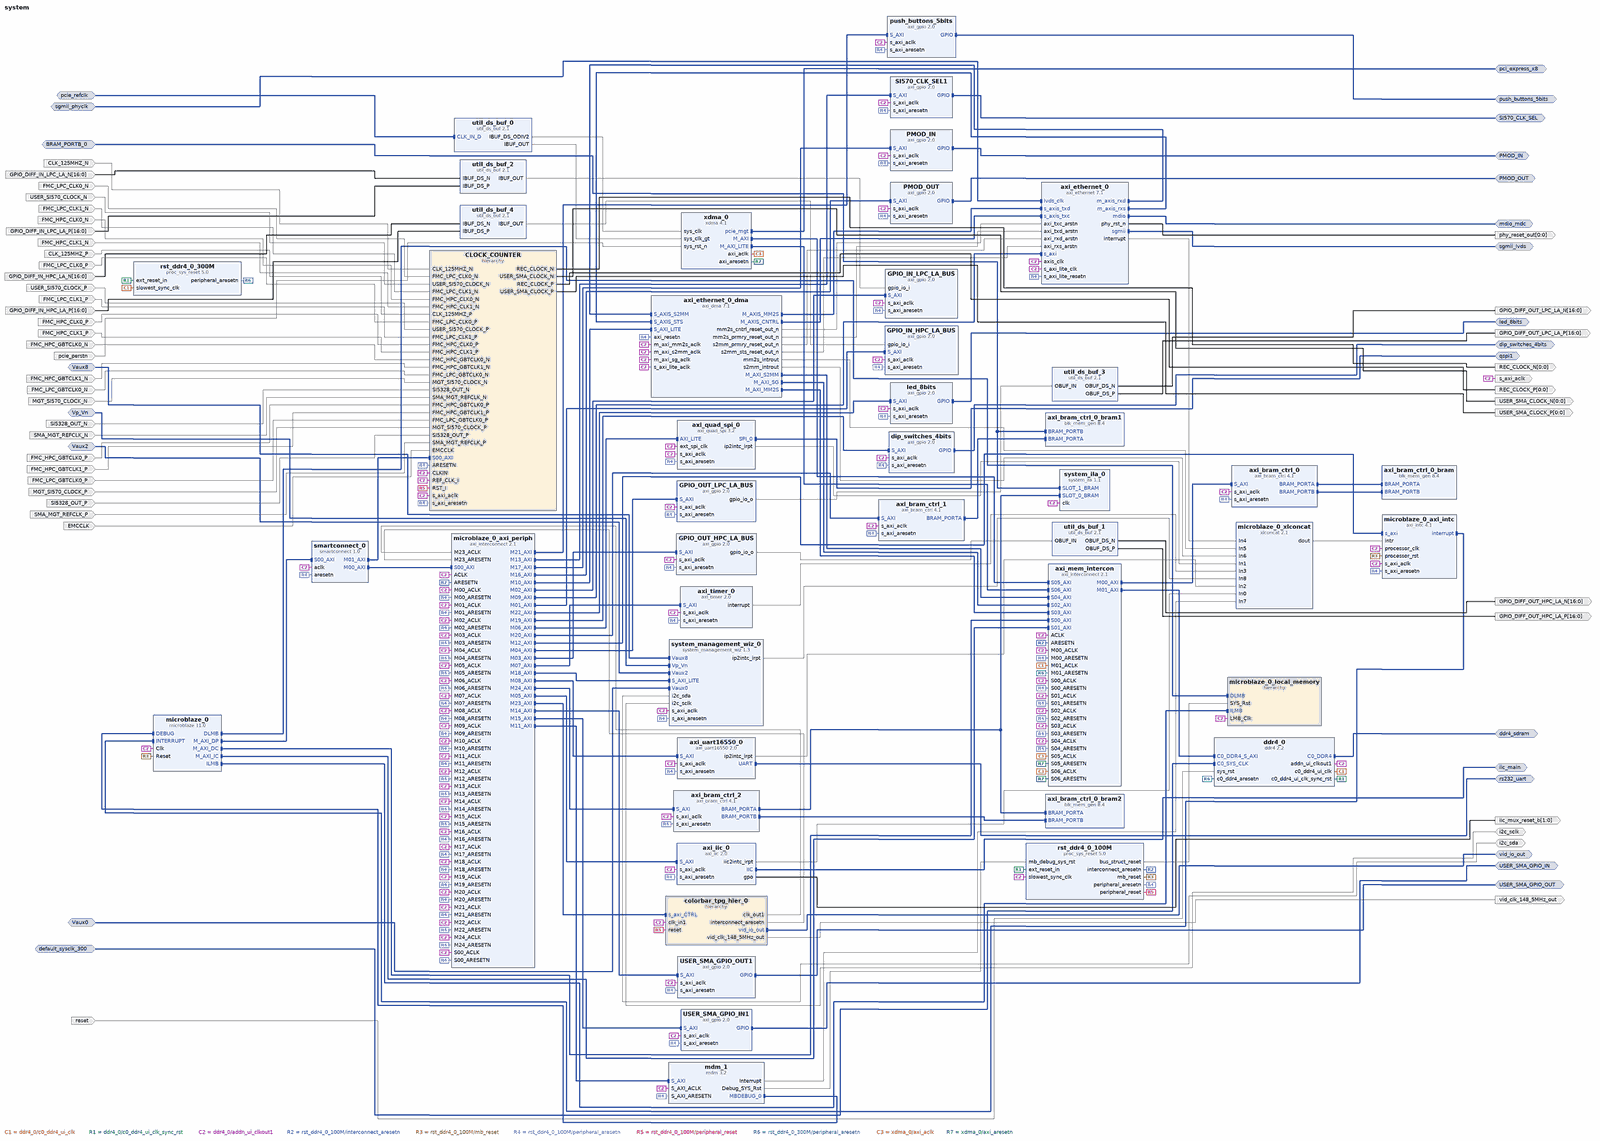
[diagram p0: block diagram of the top level, whole]
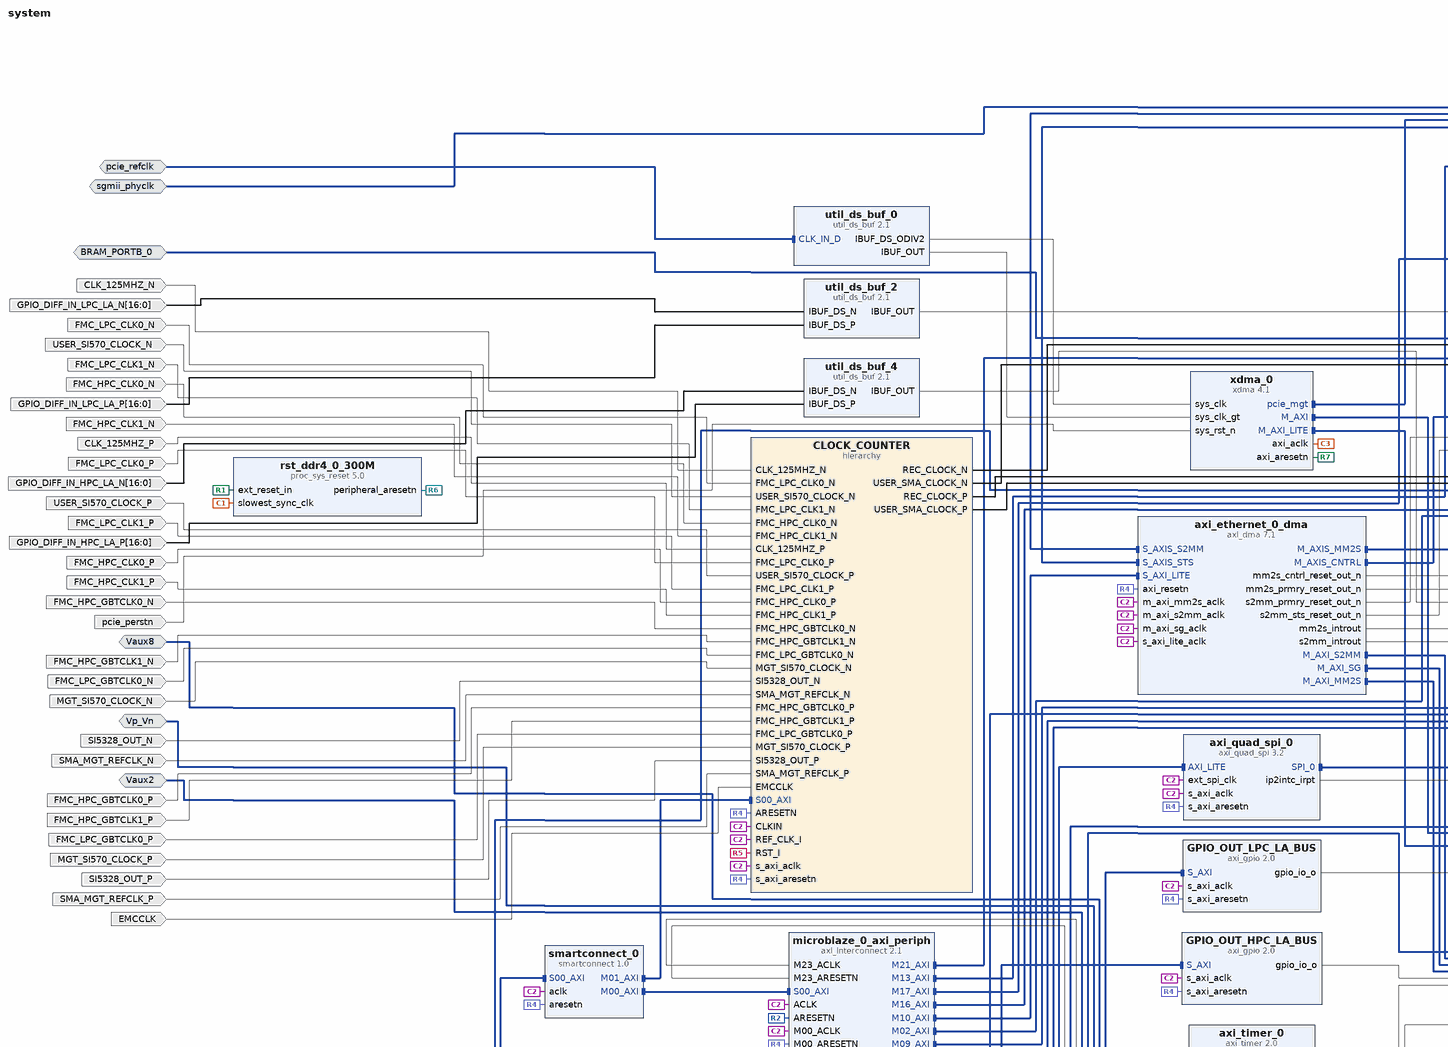
[diagram p1: block diagram of the top level, upper left part]
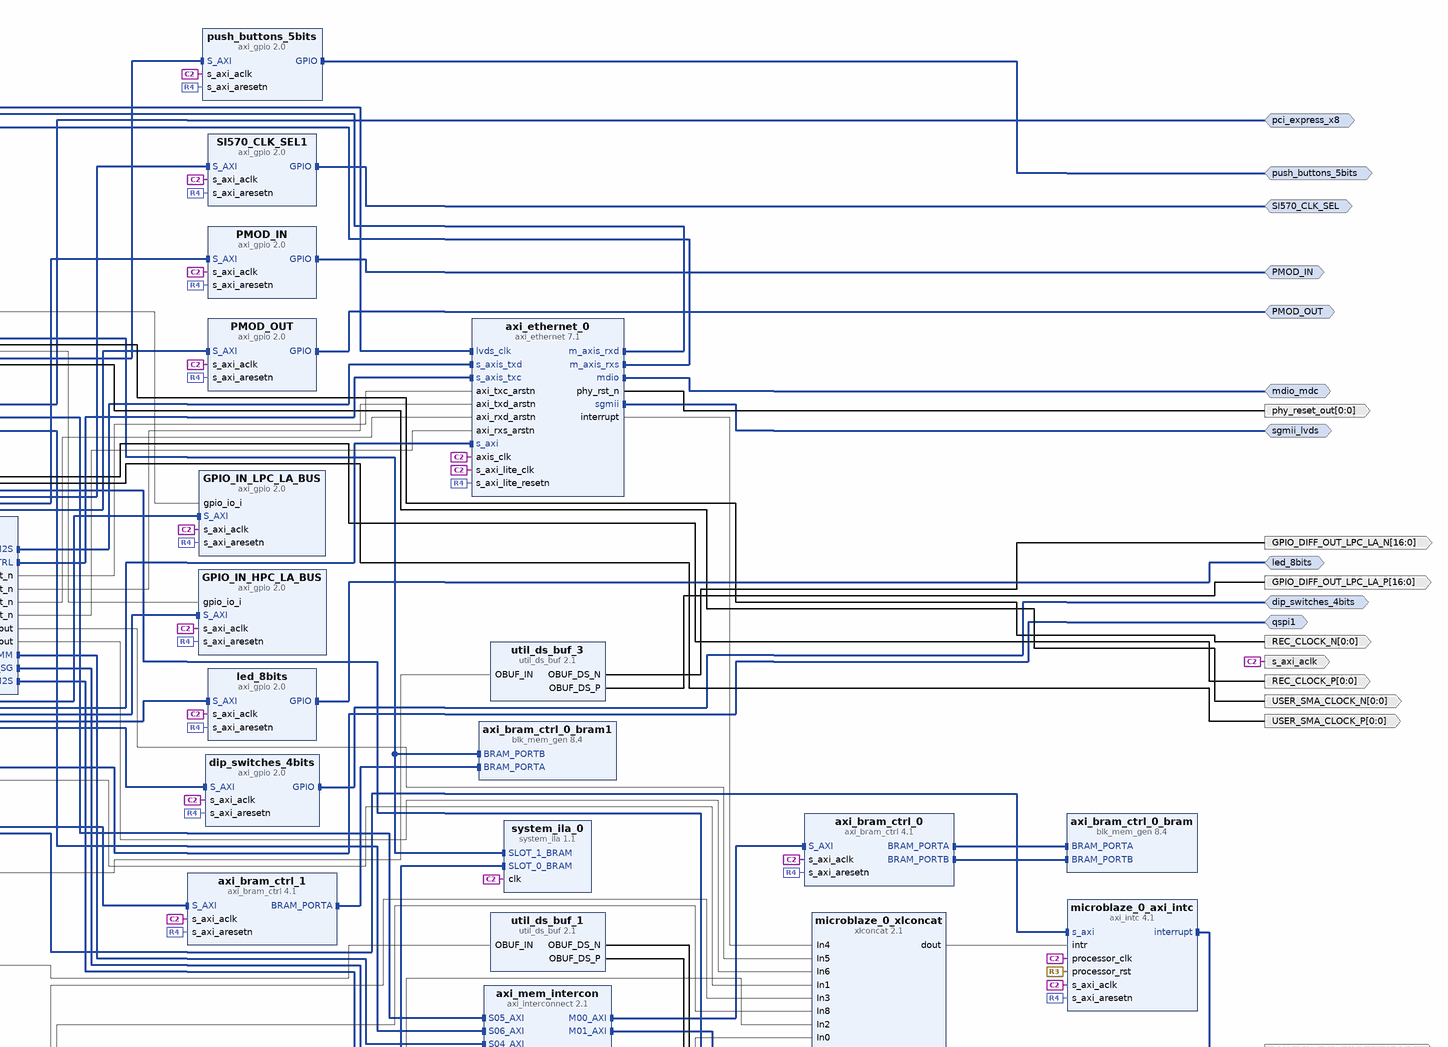
[diagram p2: block diagram of the top level, upper right part]
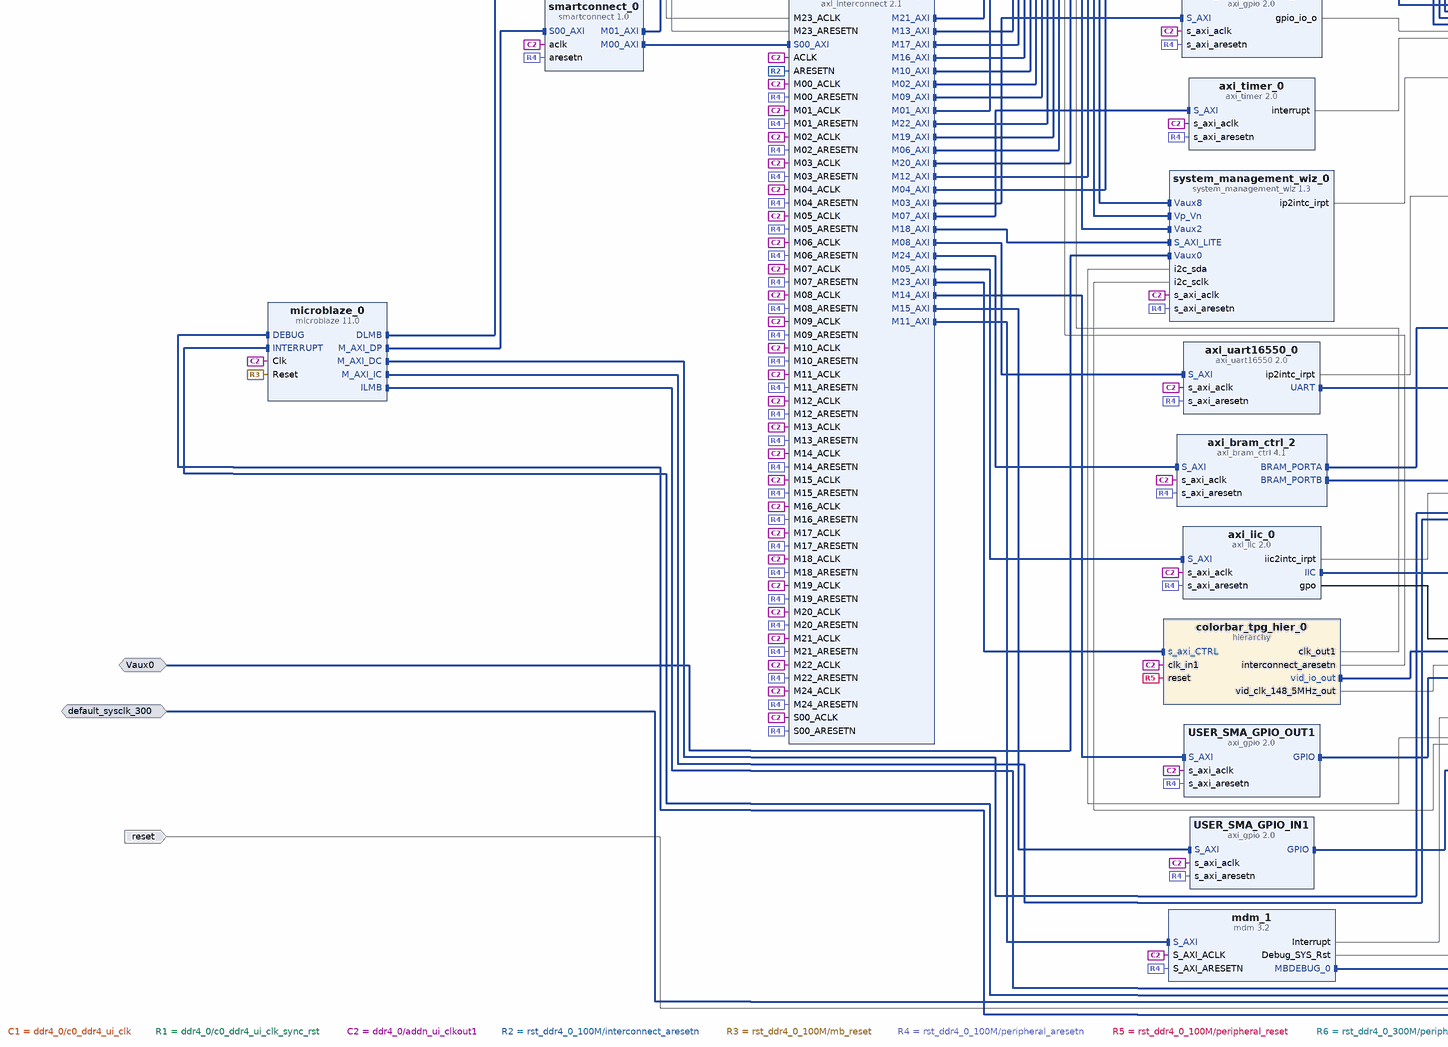
[diagram p3: block diagram of the top level, lower left part]
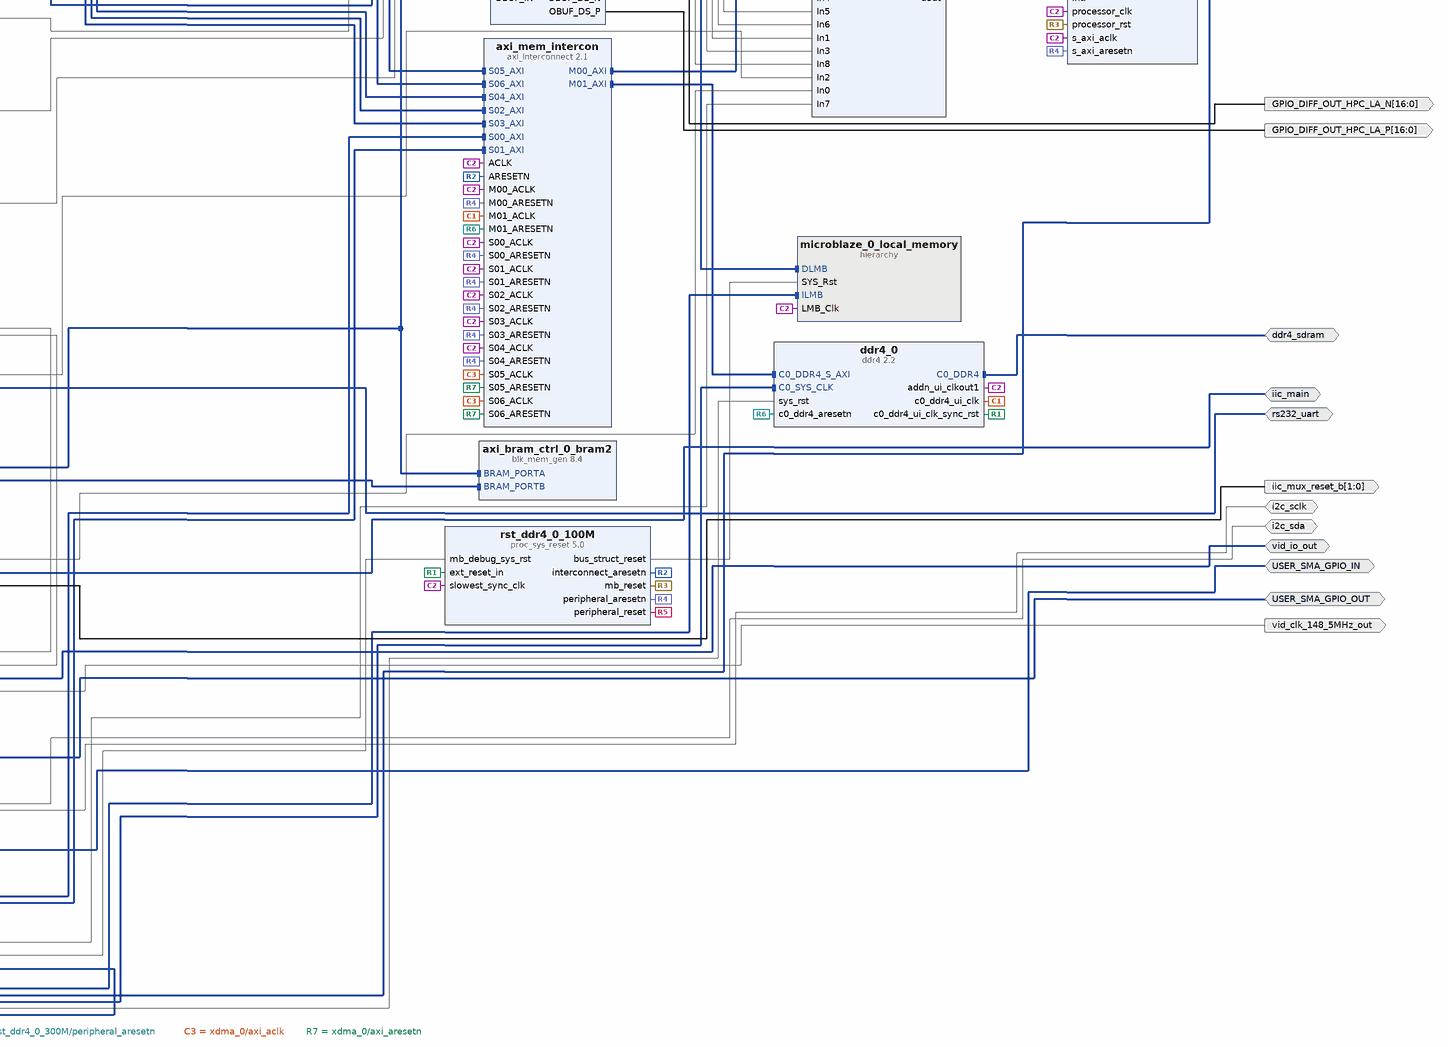
[diagram p4: block diagram of the top level, lower right part]
# Vivado block design system, xcku040-ffva1156-2-e, Vivado 2019.2
create_bd_design system

create_bd_intf_port -mode Master -vlnv xilinx.com:interface:gpio_rtl:1.0 PMOD_IN
create_bd_intf_port -mode Master -vlnv xilinx.com:interface:gpio_rtl:1.0 PMOD_OUT
create_bd_intf_port -mode Master -vlnv xilinx.com:interface:gpio_rtl:1.0 SI570_CLK_SEL
create_bd_intf_port -mode Master -vlnv xilinx.com:interface:gpio_rtl:1.0 USER_SMA_GPIO_IN
create_bd_intf_port -mode Master -vlnv xilinx.com:interface:gpio_rtl:1.0 USER_SMA_GPIO_OUT
create_bd_intf_port -mode Slave -vlnv xilinx.com:interface:diff_analog_io_rtl:1.0 Vaux0
create_bd_intf_port -mode Slave -vlnv xilinx.com:interface:diff_analog_io_rtl:1.0 Vaux2
create_bd_intf_port -mode Slave -vlnv xilinx.com:interface:diff_analog_io_rtl:1.0 Vaux8
create_bd_intf_port -mode Slave -vlnv xilinx.com:interface:diff_analog_io_rtl:1.0 Vp_Vn
create_bd_intf_port -mode Master -vlnv xilinx.com:interface:ddr4_rtl:1.0 ddr4_sdram
create_bd_intf_port -mode Master -vlnv xilinx.com:interface:gpio_rtl:1.0 dip_switches_4bits
create_bd_intf_port -mode Master -vlnv xilinx.com:interface:iic_rtl:1.0 iic_main
create_bd_intf_port -mode Master -vlnv xilinx.com:interface:gpio_rtl:1.0 led_8bits
create_bd_intf_port -mode Master -vlnv xilinx.com:interface:mdio_rtl:1.0 mdio_mdc
create_bd_intf_port -mode Master -vlnv xilinx.com:interface:pcie_7x_mgt_rtl:1.0 pci_express_x8
create_bd_intf_port -mode Master -vlnv xilinx.com:interface:gpio_rtl:1.0 push_buttons_5bits
create_bd_intf_port -mode Master -vlnv xilinx.com:interface:spi_rtl:1.0 qspi1
create_bd_intf_port -mode Master -vlnv xilinx.com:interface:uart_rtl:1.0 rs232_uart
create_bd_intf_port -mode Master -vlnv xilinx.com:interface:sgmii_rtl:1.0 sgmii_lvds
create_bd_intf_port -mode Master -vlnv xilinx.com:interface:vid_io_rtl:1.0 vid_io_out
create_bd_intf_port -mode Slave -vlnv xilinx.com:interface:diff_clock_rtl:1.0 default_sysclk_300
set_property -dict {CONFIG.FREQ_HZ 300000000} [get_bd_intf_ports default_sysclk_300]
create_bd_intf_port -mode Slave -vlnv xilinx.com:interface:diff_clock_rtl:1.0 pcie_refclk
set_property -dict {CONFIG.FREQ_HZ 100000000} [get_bd_intf_ports pcie_refclk]
create_bd_intf_port -mode Slave -vlnv xilinx.com:interface:diff_clock_rtl:1.0 sgmii_phyclk
set_property -dict {CONFIG.FREQ_HZ 625000000} [get_bd_intf_ports sgmii_phyclk]
create_bd_intf_port -mode Slave -vlnv xilinx.com:interface:bram_rtl:1.0 BRAM_PORTB_0
set_property -dict [list \
  CONFIG.MEM_SIZE 65536 \
  CONFIG.MASTER_TYPE BRAM_CTRL \
  CONFIG.READ_WRITE_MODE READ_WRITE \
] [get_bd_intf_ports BRAM_PORTB_0]
create_bd_port -dir O -from 0 -to 0 REC_CLOCK_N
create_bd_port -dir O -from 0 -to 0 USER_SMA_CLOCK_N
create_bd_port -dir O -from 0 -to 0 REC_CLOCK_P
create_bd_port -dir O -from 0 -to 0 USER_SMA_CLOCK_P
create_bd_port -dir I CLK_125MHZ_N
create_bd_port -dir I FMC_LPC_CLK0_N
create_bd_port -dir I USER_SI570_CLOCK_N
create_bd_port -dir I FMC_LPC_CLK1_N
create_bd_port -dir I FMC_HPC_CLK0_N
create_bd_port -dir I FMC_HPC_CLK1_N
create_bd_port -dir I CLK_125MHZ_P
create_bd_port -dir I FMC_LPC_CLK0_P
create_bd_port -dir I USER_SI570_CLOCK_P
create_bd_port -dir I FMC_LPC_CLK1_P
create_bd_port -dir I FMC_HPC_CLK0_P
create_bd_port -dir I FMC_HPC_CLK1_P
create_bd_port -dir I FMC_HPC_GBTCLK0_N
create_bd_port -dir I FMC_HPC_GBTCLK1_N
create_bd_port -dir I FMC_LPC_GBTCLK0_N
create_bd_port -dir I MGT_SI570_CLOCK_N
create_bd_port -dir I SI5328_OUT_N
create_bd_port -dir I SMA_MGT_REFCLK_N
create_bd_port -dir I FMC_HPC_GBTCLK0_P
create_bd_port -dir I FMC_HPC_GBTCLK1_P
create_bd_port -dir I FMC_LPC_GBTCLK0_P
create_bd_port -dir I MGT_SI570_CLOCK_P
create_bd_port -dir I SI5328_OUT_P
create_bd_port -dir I SMA_MGT_REFCLK_P
create_bd_port -dir I EMCCLK
create_bd_port -dir I -from 16 -to 0 GPIO_DIFF_IN_LPC_LA_N
create_bd_port -dir I -from 16 -to 0 GPIO_DIFF_IN_HPC_LA_N
create_bd_port -dir I -from 16 -to 0 GPIO_DIFF_IN_HPC_LA_P
create_bd_port -dir I -from 16 -to 0 GPIO_DIFF_IN_LPC_LA_P
create_bd_port -dir IO i2c_sda
create_bd_port -dir IO i2c_sclk
create_bd_port -dir O -from 0 -to 0 -type rst phy_reset_out
create_bd_port -dir O -from 1 -to 0 iic_mux_reset_b
create_bd_port -dir O vid_clk_148_5MHz_out
create_bd_port -dir I -type rst pcie_perstn
set_property -dict {CONFIG.POLARITY ACTIVE_LOW} [get_bd_ports pcie_perstn]
create_bd_port -dir I -type rst reset
set_property -dict {CONFIG.POLARITY ACTIVE_HIGH} [get_bd_ports reset]
create_bd_port -dir O -from 16 -to 0 GPIO_DIFF_OUT_HPC_LA_N
create_bd_port -dir O -from 16 -to 0 GPIO_DIFF_OUT_HPC_LA_P
create_bd_port -dir O -from 16 -to 0 GPIO_DIFF_OUT_LPC_LA_N
create_bd_port -dir O -from 16 -to 0 GPIO_DIFF_OUT_LPC_LA_P
create_bd_port -dir O -type clk s_axi_aclk

create_bd_cell -type hier CLOCK_COUNTER
create_bd_cell -type hier colorbar_tpg_hier_0
create_bd_cell -type hier microblaze_0_local_memory
create_bd_cell -type ip -vlnv xilinx.com:ip:proc_sys_reset:5.0 rst_ddr4_0_100M
create_bd_cell -type ip -vlnv xilinx.com:ip:proc_sys_reset:5.0 rst_ddr4_0_300M
create_bd_cell -type ip -vlnv xilinx.com:ip:xlconcat:2.1 microblaze_0_xlconcat
set_property -dict {CONFIG.NUM_PORTS 9 CONFIG.dout_width 9} [get_bd_cells microblaze_0_xlconcat]
create_bd_cell -type ip -vlnv xilinx.com:ip:axi_gpio:2.0 GPIO_IN_HPC_LA_BUS
set_property -dict {CONFIG.C_ALL_INPUTS 1 CONFIG.C_GPIO_WIDTH 17 CONFIG.C_IS_DUAL 0} [get_bd_cells GPIO_IN_HPC_LA_BUS]
create_bd_cell -type ip -vlnv xilinx.com:ip:axi_gpio:2.0 GPIO_IN_LPC_LA_BUS
set_property -dict {CONFIG.C_ALL_INPUTS 1 CONFIG.C_GPIO_WIDTH 17 CONFIG.C_IS_DUAL 0} [get_bd_cells GPIO_IN_LPC_LA_BUS]
create_bd_cell -type ip -vlnv xilinx.com:ip:axi_gpio:2.0 GPIO_OUT_HPC_LA_BUS
set_property -dict [list \
  CONFIG.C_ALL_INPUTS 0 \
  CONFIG.C_ALL_OUTPUTS 1 \
  CONFIG.C_GPIO_WIDTH 17 \
  CONFIG.C_IS_DUAL 0 \
] [get_bd_cells GPIO_OUT_HPC_LA_BUS]
create_bd_cell -type ip -vlnv xilinx.com:ip:axi_gpio:2.0 GPIO_OUT_LPC_LA_BUS
set_property -dict [list \
  CONFIG.C_ALL_INPUTS 0 \
  CONFIG.C_ALL_OUTPUTS 1 \
  CONFIG.C_GPIO_WIDTH 17 \
  CONFIG.C_IS_DUAL 0 \
] [get_bd_cells GPIO_OUT_LPC_LA_BUS]
create_bd_cell -type ip -vlnv xilinx.com:ip:axi_gpio:2.0 PMOD_IN
set_property -dict {CONFIG.C_ALL_INPUTS 1 CONFIG.C_GPIO_WIDTH 8} [get_bd_cells PMOD_IN]
create_bd_cell -type ip -vlnv xilinx.com:ip:axi_gpio:2.0 PMOD_OUT
set_property -dict {CONFIG.C_ALL_OUTPUTS 1 CONFIG.C_GPIO_WIDTH 8} [get_bd_cells PMOD_OUT]
create_bd_cell -type ip -vlnv xilinx.com:ip:axi_gpio:2.0 SI570_CLK_SEL1
set_property -dict {CONFIG.C_ALL_OUTPUTS 1 CONFIG.C_GPIO_WIDTH 1} [get_bd_cells SI570_CLK_SEL1]
create_bd_cell -type ip -vlnv xilinx.com:ip:axi_gpio:2.0 USER_SMA_GPIO_IN1
set_property -dict {CONFIG.C_ALL_INPUTS 1 CONFIG.C_GPIO_WIDTH 1} [get_bd_cells USER_SMA_GPIO_IN1]
create_bd_cell -type ip -vlnv xilinx.com:ip:axi_gpio:2.0 USER_SMA_GPIO_OUT1
set_property -dict {CONFIG.C_ALL_OUTPUTS 1 CONFIG.C_GPIO_WIDTH 1} [get_bd_cells USER_SMA_GPIO_OUT1]
create_bd_cell -type ip -vlnv xilinx.com:ip:axi_bram_ctrl:4.1 axi_bram_ctrl_0
create_bd_cell -type ip -vlnv xilinx.com:ip:axi_bram_ctrl:4.1 axi_bram_ctrl_1
set_property -dict {CONFIG.SINGLE_PORT_BRAM 1} [get_bd_cells axi_bram_ctrl_1]
create_bd_cell -type ip -vlnv xilinx.com:ip:axi_bram_ctrl:4.1 axi_bram_ctrl_2
create_bd_cell -type ip -vlnv xilinx.com:ip:blk_mem_gen:8.4 axi_bram_ctrl_0_bram
set_property -dict [list \
  CONFIG.EN_SAFETY_CKT false \
  CONFIG.Enable_B Use_ENB_Pin \
  CONFIG.Memory_Type True_Dual_Port_RAM \
  CONFIG.Port_B_Clock 100 \
  CONFIG.Port_B_Enable_Rate 100 \
  CONFIG.Port_B_Write_Rate 50 \
  CONFIG.Use_RSTB_Pin true \
] [get_bd_cells axi_bram_ctrl_0_bram]
create_bd_cell -type ip -vlnv xilinx.com:ip:blk_mem_gen:8.4 axi_bram_ctrl_0_bram1
set_property -dict [list \
  CONFIG.EN_SAFETY_CKT false \
  CONFIG.Enable_B Use_ENB_Pin \
  CONFIG.Memory_Type True_Dual_Port_RAM \
  CONFIG.Port_B_Clock 100 \
  CONFIG.Port_B_Enable_Rate 100 \
  CONFIG.Port_B_Write_Rate 50 \
  CONFIG.Use_RSTB_Pin true \
] [get_bd_cells axi_bram_ctrl_0_bram1]
create_bd_cell -type ip -vlnv xilinx.com:ip:blk_mem_gen:8.4 axi_bram_ctrl_0_bram2
set_property -dict [list \
  CONFIG.EN_SAFETY_CKT false \
  CONFIG.Enable_B Use_ENB_Pin \
  CONFIG.Memory_Type True_Dual_Port_RAM \
  CONFIG.Port_B_Clock 100 \
  CONFIG.Port_B_Enable_Rate 100 \
  CONFIG.Port_B_Write_Rate 50 \
  CONFIG.Use_RSTB_Pin true \
] [get_bd_cells axi_bram_ctrl_0_bram2]
create_bd_cell -type ip -vlnv xilinx.com:ip:axi_ethernet:7.1 axi_ethernet_0
set_property -dict [list \
  CONFIG.DIFFCLK_BOARD_INTERFACE sgmii_phyclk \
  CONFIG.ETHERNET_BOARD_INTERFACE sgmii_lvds \
  CONFIG.MDIO_BOARD_INTERFACE mdio_mdc \
  CONFIG.PHYRST_BOARD_INTERFACE phy_reset_out \
  CONFIG.lvdsclkrate 625 \
] [get_bd_cells axi_ethernet_0]
create_bd_cell -type ip -vlnv xilinx.com:ip:axi_dma:7.1 axi_ethernet_0_dma
set_property -dict [list \
  CONFIG.c_include_mm2s_dre 1 \
  CONFIG.c_include_s2mm_dre 1 \
  CONFIG.c_sg_length_width 16 \
  CONFIG.c_sg_use_stsapp_length 1 \
] [get_bd_cells axi_ethernet_0_dma]
create_bd_cell -type ip -vlnv xilinx.com:ip:axi_iic:2.0 axi_iic_0
set_property -dict [list \
  CONFIG.C_DEFAULT_VALUE 0xFF \
  CONFIG.C_GPO_WIDTH 2 \
  CONFIG.C_SCL_INERTIAL_DELAY 50 \
  CONFIG.C_SDA_INERTIAL_DELAY 50 \
  CONFIG.IIC_BOARD_INTERFACE iic_main \
  CONFIG.USE_BOARD_FLOW true \
] [get_bd_cells axi_iic_0]
create_bd_cell -type ip -vlnv xilinx.com:ip:axi_interconnect:2.1 axi_mem_intercon
set_property -dict {CONFIG.NUM_MI 2 CONFIG.NUM_SI 7 CONFIG.SYNCHRONIZATION_STAGES 2} [get_bd_cells axi_mem_intercon]
create_bd_cell -type ip -vlnv xilinx.com:ip:axi_quad_spi:3.2 axi_quad_spi_0
set_property -dict {CONFIG.C_SPI_MEMORY 2 CONFIG.C_SPI_MODE 2 CONFIG.C_S_AXI4_ID_WIDTH 0} [get_bd_cells axi_quad_spi_0]
create_bd_cell -type ip -vlnv xilinx.com:ip:axi_timer:2.0 axi_timer_0
create_bd_cell -type ip -vlnv xilinx.com:ip:axi_uart16550:2.0 axi_uart16550_0
set_property -dict {CONFIG.UART_BOARD_INTERFACE rs232_uart CONFIG.USE_BOARD_FLOW true} [get_bd_cells axi_uart16550_0]
create_bd_cell -type ip -vlnv xilinx.com:ip:ddr4:2.2 ddr4_0
set_property -dict [list \
  CONFIG.ADDN_UI_CLKOUT1_FREQ_HZ 100 \
  CONFIG.C0.BANK_GROUP_WIDTH 1 \
  CONFIG.C0.DDR4_AxiAddressWidth 31 \
  CONFIG.C0_CLOCK_BOARD_INTERFACE default_sysclk_300 \
  CONFIG.C0_DDR4_BOARD_INTERFACE ddr4_sdram \
  CONFIG.RESET_BOARD_INTERFACE reset \
] [get_bd_cells ddr4_0]
create_bd_cell -type ip -vlnv xilinx.com:ip:axi_gpio:2.0 dip_switches_4bits
set_property -dict {CONFIG.GPIO_BOARD_INTERFACE dip_switches_4bits CONFIG.USE_BOARD_FLOW true} [get_bd_cells dip_switches_4bits]
create_bd_cell -type ip -vlnv xilinx.com:ip:axi_gpio:2.0 led_8bits
set_property -dict {CONFIG.GPIO_BOARD_INTERFACE led_8bits CONFIG.USE_BOARD_FLOW true} [get_bd_cells led_8bits]
create_bd_cell -type ip -vlnv xilinx.com:ip:mdm:3.2 mdm_1
set_property -dict {CONFIG.C_USE_UART 1} [get_bd_cells mdm_1]
create_bd_cell -type ip -vlnv xilinx.com:ip:microblaze:11.0 microblaze_0
set_property -dict [list \
  CONFIG.C_ADDR_TAG_BITS 18 \
  CONFIG.C_CACHE_BYTE_SIZE 8192 \
  CONFIG.C_DCACHE_ADDR_TAG 17 \
  CONFIG.C_DCACHE_BYTE_SIZE 8192 \
  CONFIG.C_DEBUG_ENABLED 1 \
  CONFIG.C_D_AXI 1 \
  CONFIG.C_D_LMB 1 \
  CONFIG.C_I_LMB 1 \
  CONFIG.C_USE_DCACHE 1 \
  CONFIG.C_USE_ICACHE 1 \
] [get_bd_cells microblaze_0]
create_bd_cell -type ip -vlnv xilinx.com:ip:axi_intc:4.1 microblaze_0_axi_intc
set_property -dict {CONFIG.C_HAS_FAST 1} [get_bd_cells microblaze_0_axi_intc]
create_bd_cell -type ip -vlnv xilinx.com:ip:axi_interconnect:2.1 microblaze_0_axi_periph
set_property -dict {CONFIG.NUM_MI 25 CONFIG.SYNCHRONIZATION_STAGES 2} [get_bd_cells microblaze_0_axi_periph]
create_bd_cell -type ip -vlnv xilinx.com:ip:axi_gpio:2.0 push_buttons_5bits
set_property -dict {CONFIG.GPIO_BOARD_INTERFACE push_buttons_5bits CONFIG.USE_BOARD_FLOW true} [get_bd_cells push_buttons_5bits]
create_bd_cell -type ip -vlnv xilinx.com:ip:smartconnect:1.0 smartconnect_0
set_property -dict {CONFIG.NUM_MI 2 CONFIG.NUM_SI 1} [get_bd_cells smartconnect_0]
create_bd_cell -type ip -vlnv xilinx.com:ip:system_ila:1.1 system_ila_0
set_property -dict [list \
  CONFIG.C_MON_TYPE INTERFACE \
  CONFIG.C_NUM_MONITOR_SLOTS 2 \
  CONFIG.C_SLOT 1 \
  CONFIG.C_SLOT_0_INTF_TYPE xilinx.com:interface:bram_rtl:1.0 \
  CONFIG.C_SLOT_1_INTF_TYPE xilinx.com:interface:bram_rtl:1.0 \
] [get_bd_cells system_ila_0]
create_bd_cell -type ip -vlnv xilinx.com:ip:system_management_wiz:1.3 system_management_wiz_0
set_property -dict [list \
  CONFIG.ADC_OFFSET_CALIBRATION false \
  CONFIG.ANALOG_BANK_SELECTION 66 \
  CONFIG.CHANNEL_ENABLE_VAUXP0_VAUXN0 true \
  CONFIG.CHANNEL_ENABLE_VAUXP2_VAUXN2 true \
  CONFIG.CHANNEL_ENABLE_VAUXP8_VAUXN8 true \
  CONFIG.CHANNEL_ENABLE_VUSER0 true \
  CONFIG.CHANNEL_ENABLE_VUSER1 true \
  CONFIG.CHANNEL_ENABLE_VUSER2 true \
  CONFIG.CHANNEL_ENABLE_VUSER3 true \
  CONFIG.ENABLE_I2C true \
  CONFIG.INTERFACE_SELECTION Enable_AXI \
  CONFIG.USER_SUPPLY0_ALARM false \
  CONFIG.USER_SUPPLY0_BANK 44 \
  CONFIG.USER_SUPPLY1_BANK 48 \
  CONFIG.VAUXN0_LOC E13 \
  CONFIG.VAUXN10_LOC K12 \
  CONFIG.VAUXN11_LOC J11 \
  CONFIG.VAUXN12_LOC H8 \
  CONFIG.VAUXN13_LOC K8 \
  CONFIG.VAUXN14_LOC C9 \
  CONFIG.VAUXN15_LOC C8 \
  CONFIG.VAUXN1_LOC B12 \
  CONFIG.VAUXN2_LOC H13 \
  CONFIG.VAUXN3_LOC K13 \
  CONFIG.VAUXN4_LOC J10 \
  CONFIG.VAUXN5_LOC H9 \
  CONFIG.VAUXN6_LOC D10 \
  CONFIG.VAUXN7_LOC A10 \
  CONFIG.VAUXN8_LOC B11 \
  CONFIG.VAUXN9_LOC D11 \
  CONFIG.VAUXP0_LOC F13 \
  CONFIG.VAUXP10_LOC L12 \
  CONFIG.VAUXP11_LOC K11 \
  CONFIG.VAUXP12_LOC J8 \
  CONFIG.VAUXP13_LOC L8 \
  CONFIG.VAUXP14_LOC D9 \
  CONFIG.VAUXP15_LOC D8 \
  CONFIG.VAUXP1_LOC C12 \
  CONFIG.VAUXP2_LOC J13 \
  CONFIG.VAUXP3_LOC L13 \
  CONFIG.VAUXP4_LOC K10 \
  CONFIG.VAUXP5_LOC J9 \
  CONFIG.VAUXP6_LOC E10 \
  CONFIG.VAUXP7_LOC B10 \
  CONFIG.VAUXP8_LOC C11 \
  CONFIG.VAUXP9_LOC E11 \
] [get_bd_cells system_management_wiz_0]
create_bd_cell -type ip -vlnv xilinx.com:ip:util_ds_buf:2.1 util_ds_buf_0
set_property -dict {CONFIG.DIFF_CLK_IN_BOARD_INTERFACE pcie_refclk CONFIG.USE_BOARD_FLOW true} [get_bd_cells util_ds_buf_0]
create_bd_cell -type ip -vlnv xilinx.com:ip:util_ds_buf:2.1 util_ds_buf_1
set_property -dict {CONFIG.C_BUF_TYPE OBUFDS CONFIG.C_SIZE 17} [get_bd_cells util_ds_buf_1]
create_bd_cell -type ip -vlnv xilinx.com:ip:util_ds_buf:2.1 util_ds_buf_2
set_property -dict {CONFIG.C_SIZE 17} [get_bd_cells util_ds_buf_2]
create_bd_cell -type ip -vlnv xilinx.com:ip:util_ds_buf:2.1 util_ds_buf_3
set_property -dict {CONFIG.C_BUF_TYPE OBUFDS CONFIG.C_SIZE 17} [get_bd_cells util_ds_buf_3]
create_bd_cell -type ip -vlnv xilinx.com:ip:util_ds_buf:2.1 util_ds_buf_4
set_property -dict {CONFIG.C_BUF_TYPE IBUFDS CONFIG.C_SIZE 17} [get_bd_cells util_ds_buf_4]
create_bd_cell -type ip -vlnv xilinx.com:ip:xdma:4.1 xdma_0
set_property -dict [list \
  CONFIG.PCIE_BOARD_INTERFACE pci_express_x8 \
  CONFIG.PF0_DEVICE_ID_mqdma 9038 \
  CONFIG.PF2_DEVICE_ID_mqdma 9038 \
  CONFIG.PF3_DEVICE_ID_mqdma 9038 \
  CONFIG.SYS_RST_N_BOARD_INTERFACE pcie_perstn \
  CONFIG.axi_data_width 256_bit \
  CONFIG.axilite_master_en true \
  CONFIG.axisten_freq 250 \
  CONFIG.barlite2 0 \
  CONFIG.en_ext_ch_gt_drp false \
  CONFIG.enable_gen4 false \
  CONFIG.pcie_id_if false \
  CONFIG.pciebar2axibar_axil_master 0x0000000000000000 \
  CONFIG.pf0_device_id 8038 \
  CONFIG.pf0_rbar_cap_bar0 0xffffffffffff \
  CONFIG.pf1_bar0_scale Kilobytes \
  CONFIG.pf1_bar0_size 128 \
  CONFIG.pf1_bar1_enabled false \
  CONFIG.pf1_msix_cap_table_size 020 \
  CONFIG.pf1_rbar_cap_bar0 0xffffffffffff \
  CONFIG.pf2_rbar_cap_bar0 0xffffffffffff \
  CONFIG.pf3_rbar_cap_bar0 0xffffffffffff \
  CONFIG.pl_link_cap_max_link_speed 8.0_GT/s \
  CONFIG.plltype QPLL1 \
] [get_bd_cells xdma_0]

# ---- hierarchy /CLOCK_COUNTER ----
current_bd_instance /CLOCK_COUNTER
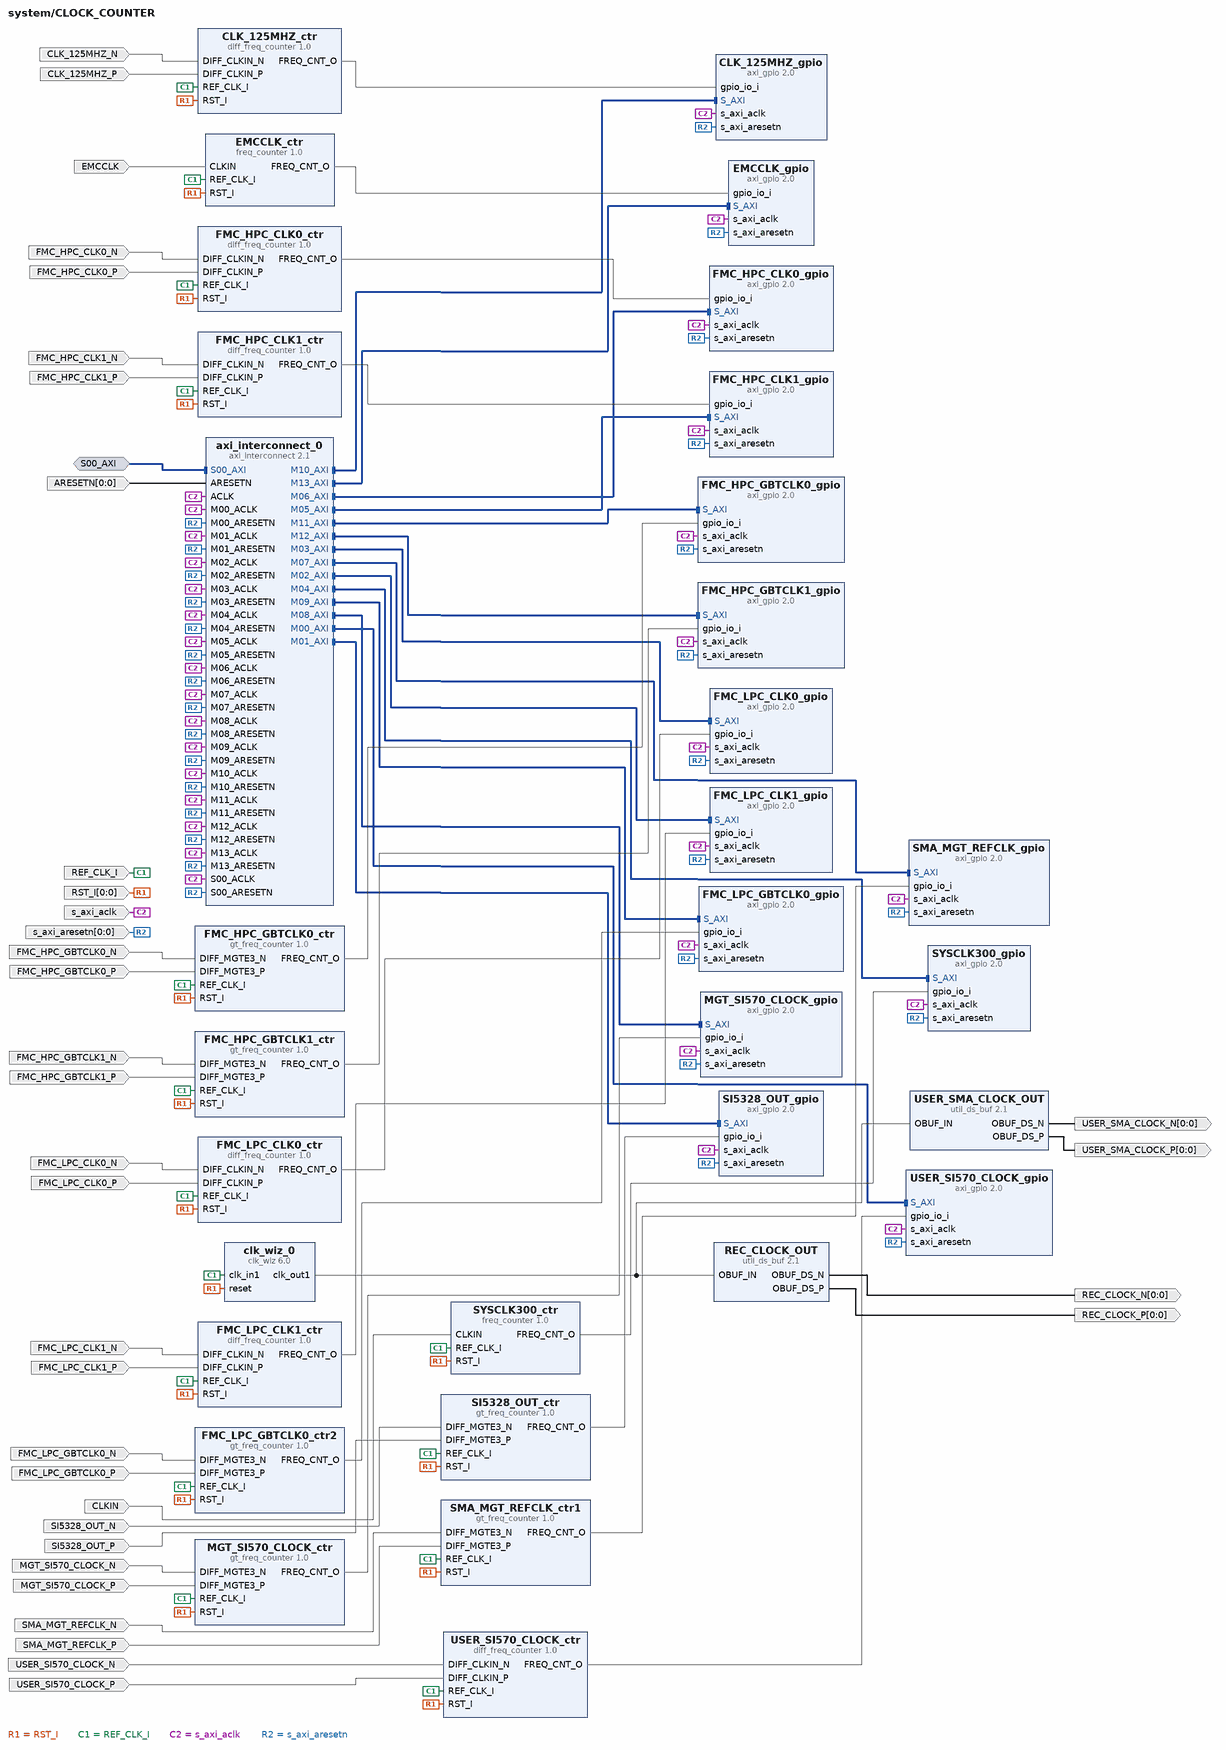
[diagram p5: block diagram inside /CLOCK_COUNTER]
create_bd_intf_pin -mode Slave -vlnv xilinx.com:interface:aximm_rtl:1.0 S00_AXI
create_bd_pin -dir I -from 0 -to 0 -type rst ARESETN
create_bd_pin -dir I CLKIN
create_bd_pin -dir I CLK_125MHZ_N
create_bd_pin -dir I CLK_125MHZ_P
create_bd_pin -dir I EMCCLK
create_bd_pin -dir I FMC_HPC_CLK0_N
create_bd_pin -dir I FMC_HPC_CLK0_P
create_bd_pin -dir I FMC_HPC_CLK1_N
create_bd_pin -dir I FMC_HPC_CLK1_P
create_bd_pin -dir I FMC_HPC_GBTCLK0_N
create_bd_pin -dir I FMC_HPC_GBTCLK0_P
create_bd_pin -dir I FMC_HPC_GBTCLK1_N
create_bd_pin -dir I FMC_HPC_GBTCLK1_P
create_bd_pin -dir I FMC_LPC_CLK0_N
create_bd_pin -dir I FMC_LPC_CLK0_P
create_bd_pin -dir I FMC_LPC_CLK1_N
create_bd_pin -dir I FMC_LPC_CLK1_P
create_bd_pin -dir I FMC_LPC_GBTCLK0_N
create_bd_pin -dir I FMC_LPC_GBTCLK0_P
create_bd_pin -dir I MGT_SI570_CLOCK_N
create_bd_pin -dir I MGT_SI570_CLOCK_P
create_bd_pin -dir O -from 0 -to 0 REC_CLOCK_N
create_bd_pin -dir O -from 0 -to 0 REC_CLOCK_P
create_bd_pin -dir I REF_CLK_I
create_bd_pin -dir I -from 0 -to 0 RST_I
create_bd_pin -dir I SI5328_OUT_N
create_bd_pin -dir I SI5328_OUT_P
create_bd_pin -dir I SMA_MGT_REFCLK_N
create_bd_pin -dir I SMA_MGT_REFCLK_P
create_bd_pin -dir I USER_SI570_CLOCK_N
create_bd_pin -dir I USER_SI570_CLOCK_P
create_bd_pin -dir O -from 0 -to 0 USER_SMA_CLOCK_N
create_bd_pin -dir O -from 0 -to 0 USER_SMA_CLOCK_P
create_bd_pin -dir I -type clk s_axi_aclk
create_bd_pin -dir I -from 0 -to 0 -type rst s_axi_aresetn

create_bd_cell -type ip -vlnv xilinx.com:ip:diff_freq_counter:1.0 CLK_125MHZ_ctr
create_bd_cell -type ip -vlnv xilinx.com:ip:freq_counter:1.0 EMCCLK_ctr
create_bd_cell -type ip -vlnv xilinx.com:ip:diff_freq_counter:1.0 FMC_HPC_CLK0_ctr
create_bd_cell -type ip -vlnv xilinx.com:ip:diff_freq_counter:1.0 FMC_HPC_CLK1_ctr
create_bd_cell -type ip -vlnv xilinx.com:ip:gt_freq_counter:1.0 FMC_HPC_GBTCLK0_ctr
create_bd_cell -type ip -vlnv xilinx.com:ip:gt_freq_counter:1.0 FMC_HPC_GBTCLK1_ctr
create_bd_cell -type ip -vlnv xilinx.com:ip:diff_freq_counter:1.0 FMC_LPC_CLK0_ctr
create_bd_cell -type ip -vlnv xilinx.com:ip:diff_freq_counter:1.0 FMC_LPC_CLK1_ctr
create_bd_cell -type ip -vlnv xilinx.com:ip:gt_freq_counter:1.0 FMC_LPC_GBTCLK0_ctr2
create_bd_cell -type ip -vlnv xilinx.com:ip:gt_freq_counter:1.0 MGT_SI570_CLOCK_ctr
create_bd_cell -type ip -vlnv xilinx.com:ip:gt_freq_counter:1.0 SI5328_OUT_ctr
create_bd_cell -type ip -vlnv xilinx.com:ip:gt_freq_counter:1.0 SMA_MGT_REFCLK_ctr1
create_bd_cell -type ip -vlnv xilinx.com:ip:freq_counter:1.0 SYSCLK300_ctr
create_bd_cell -type ip -vlnv xilinx.com:ip:diff_freq_counter:1.0 USER_SI570_CLOCK_ctr
create_bd_cell -type ip -vlnv xilinx.com:ip:axi_gpio:2.0 CLK_125MHZ_gpio
set_property -dict {CONFIG.C_ALL_INPUTS 1 CONFIG.C_GPIO_WIDTH 16} [get_bd_cells CLK_125MHZ_gpio]
create_bd_cell -type ip -vlnv xilinx.com:ip:axi_gpio:2.0 EMCCLK_gpio
set_property -dict {CONFIG.C_ALL_INPUTS 1 CONFIG.C_GPIO_WIDTH 16} [get_bd_cells EMCCLK_gpio]
create_bd_cell -type ip -vlnv xilinx.com:ip:axi_gpio:2.0 FMC_HPC_CLK0_gpio
set_property -dict {CONFIG.C_ALL_INPUTS 1 CONFIG.C_GPIO_WIDTH 16} [get_bd_cells FMC_HPC_CLK0_gpio]
create_bd_cell -type ip -vlnv xilinx.com:ip:axi_gpio:2.0 FMC_HPC_CLK1_gpio
set_property -dict {CONFIG.C_ALL_INPUTS 1 CONFIG.C_GPIO_WIDTH 16} [get_bd_cells FMC_HPC_CLK1_gpio]
create_bd_cell -type ip -vlnv xilinx.com:ip:axi_gpio:2.0 FMC_HPC_GBTCLK0_gpio
set_property -dict {CONFIG.C_ALL_INPUTS 1 CONFIG.C_GPIO_WIDTH 16} [get_bd_cells FMC_HPC_GBTCLK0_gpio]
create_bd_cell -type ip -vlnv xilinx.com:ip:axi_gpio:2.0 FMC_HPC_GBTCLK1_gpio
set_property -dict {CONFIG.C_ALL_INPUTS 1 CONFIG.C_GPIO_WIDTH 16} [get_bd_cells FMC_HPC_GBTCLK1_gpio]
create_bd_cell -type ip -vlnv xilinx.com:ip:axi_gpio:2.0 FMC_LPC_CLK0_gpio
set_property -dict {CONFIG.C_ALL_INPUTS 1 CONFIG.C_GPIO_WIDTH 16} [get_bd_cells FMC_LPC_CLK0_gpio]
create_bd_cell -type ip -vlnv xilinx.com:ip:axi_gpio:2.0 FMC_LPC_CLK1_gpio
set_property -dict {CONFIG.C_ALL_INPUTS 1 CONFIG.C_GPIO_WIDTH 16} [get_bd_cells FMC_LPC_CLK1_gpio]
create_bd_cell -type ip -vlnv xilinx.com:ip:axi_gpio:2.0 FMC_LPC_GBTCLK0_gpio
set_property -dict {CONFIG.C_ALL_INPUTS 1 CONFIG.C_GPIO_WIDTH 16} [get_bd_cells FMC_LPC_GBTCLK0_gpio]
create_bd_cell -type ip -vlnv xilinx.com:ip:axi_gpio:2.0 MGT_SI570_CLOCK_gpio
set_property -dict {CONFIG.C_ALL_INPUTS 1 CONFIG.C_GPIO_WIDTH 16} [get_bd_cells MGT_SI570_CLOCK_gpio]
create_bd_cell -type ip -vlnv xilinx.com:ip:util_ds_buf:2.1 REC_CLOCK_OUT
set_property -dict {CONFIG.C_BUF_TYPE OBUFDS} [get_bd_cells REC_CLOCK_OUT]
create_bd_cell -type ip -vlnv xilinx.com:ip:axi_gpio:2.0 SI5328_OUT_gpio
set_property -dict {CONFIG.C_ALL_INPUTS 1 CONFIG.C_GPIO_WIDTH 16} [get_bd_cells SI5328_OUT_gpio]
create_bd_cell -type ip -vlnv xilinx.com:ip:axi_gpio:2.0 SMA_MGT_REFCLK_gpio
set_property -dict {CONFIG.C_ALL_INPUTS 1 CONFIG.C_GPIO_WIDTH 16} [get_bd_cells SMA_MGT_REFCLK_gpio]
create_bd_cell -type ip -vlnv xilinx.com:ip:axi_gpio:2.0 SYSCLK300_gpio
set_property -dict {CONFIG.C_ALL_INPUTS 1 CONFIG.C_GPIO_WIDTH 16} [get_bd_cells SYSCLK300_gpio]
create_bd_cell -type ip -vlnv xilinx.com:ip:axi_gpio:2.0 USER_SI570_CLOCK_gpio
set_property -dict {CONFIG.C_ALL_INPUTS 1 CONFIG.C_GPIO_WIDTH 16} [get_bd_cells USER_SI570_CLOCK_gpio]
create_bd_cell -type ip -vlnv xilinx.com:ip:util_ds_buf:2.1 USER_SMA_CLOCK_OUT
set_property -dict {CONFIG.C_BUF_TYPE OBUFDS} [get_bd_cells USER_SMA_CLOCK_OUT]
create_bd_cell -type ip -vlnv xilinx.com:ip:axi_interconnect:2.1 axi_interconnect_0
set_property -dict {CONFIG.NUM_MI 14 CONFIG.SYNCHRONIZATION_STAGES 2} [get_bd_cells axi_interconnect_0]
create_bd_cell -type ip -vlnv xilinx.com:ip:clk_wiz:6.0 clk_wiz_0
set_property -dict [list \
  CONFIG.CLKOUT1_JITTER 197.719 \
  CONFIG.CLKOUT1_PHASE_ERROR 233.132 \
  CONFIG.CLKOUT1_REQUESTED_OUT_FREQ 156.25 \
  CONFIG.MMCM_CLKFBOUT_MULT_F 40.625 \
  CONFIG.MMCM_CLKOUT0_DIVIDE_F 6.500 \
  CONFIG.MMCM_DIVCLK_DIVIDE 4 \
  CONFIG.RESET_PORT reset \
  CONFIG.RESET_TYPE ACTIVE_HIGH \
  CONFIG.USE_LOCKED false \
  CONFIG.USE_PHASE_ALIGNMENT true \
] [get_bd_cells clk_wiz_0]

# ---- hierarchy /colorbar_tpg_hier_0 ----
current_bd_instance /colorbar_tpg_hier_0
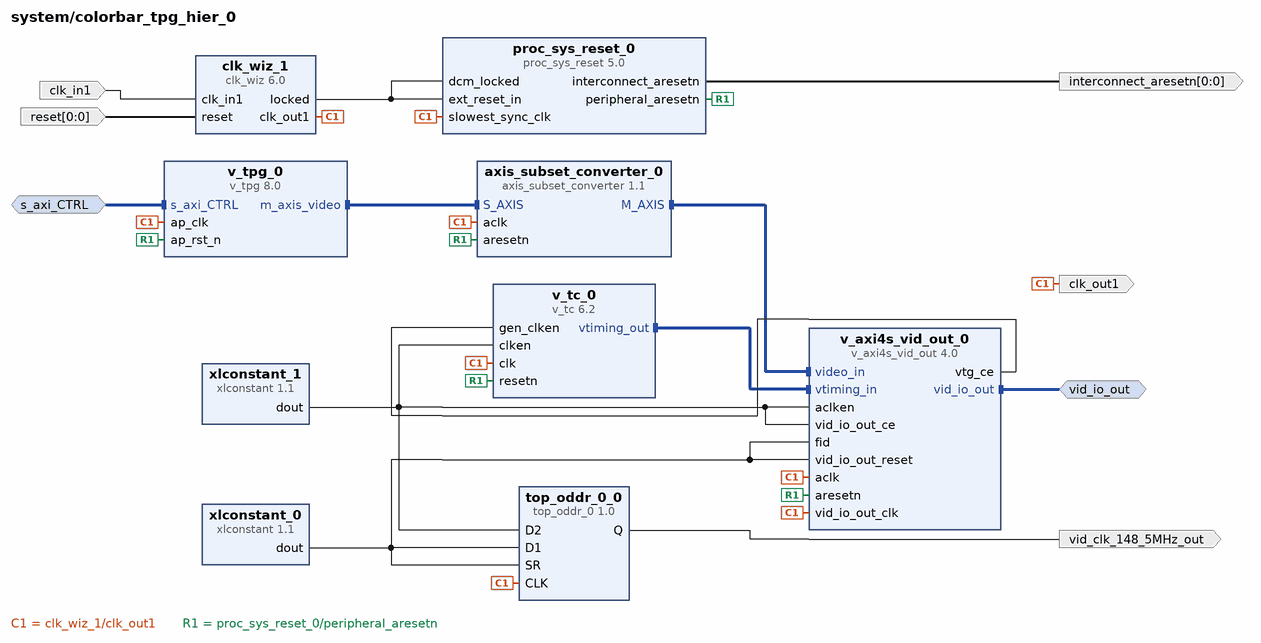
[diagram p6: block diagram inside /colorbar_tpg_hier_0]
create_bd_intf_pin -mode Slave -vlnv xilinx.com:interface:aximm_rtl:1.0 s_axi_CTRL
create_bd_intf_pin -mode Master -vlnv xilinx.com:interface:vid_io_rtl:1.0 vid_io_out
create_bd_pin -dir I -type clk clk_in1
create_bd_pin -dir O -type clk clk_out1
create_bd_pin -dir O -from 0 -to 0 -type rst interconnect_aresetn
create_bd_pin -dir I -from 0 -to 0 -type rst reset
create_bd_pin -dir O vid_clk_148_5MHz_out

create_bd_cell -type ip -vlnv xilinx.com:user:top_oddr_0:1.0 top_oddr_0_0
create_bd_cell -type ip -vlnv xilinx.com:ip:proc_sys_reset:5.0 proc_sys_reset_0
set_property -dict {CONFIG.C_AUX_RESET_HIGH 0} [get_bd_cells proc_sys_reset_0]
create_bd_cell -type ip -vlnv xilinx.com:ip:v_axi4s_vid_out:4.0 v_axi4s_vid_out_0
set_property -dict [list \
  CONFIG.C_ADDR_WIDTH 10 \
  CONFIG.C_HAS_ASYNC_CLK 1 \
  CONFIG.C_S_AXIS_VIDEO_FORMAT 0 \
  CONFIG.C_VTG_MASTER_SLAVE 0 \
] [get_bd_cells v_axi4s_vid_out_0]
create_bd_cell -type ip -vlnv xilinx.com:ip:axis_subset_converter:1.1 axis_subset_converter_0
set_property -dict [list \
  CONFIG.M_TDATA_NUM_BYTES 2 \
  CONFIG.S_TDATA_NUM_BYTES 3 \
  CONFIG.TDATA_REMAP {tdata[15:0]} \
  CONFIG.TDEST_REMAP {tdest[0:0]} \
  CONFIG.TID_REMAP {tid[0:0]} \
  CONFIG.TKEEP_REMAP {tkeep[1:0]} \
  CONFIG.TLAST_REMAP {tlast[0]} \
  CONFIG.TSTRB_REMAP {tstrb[1:0]} \
  CONFIG.TUSER_REMAP {tuser[0:0]} \
] [get_bd_cells axis_subset_converter_0]
create_bd_cell -type ip -vlnv xilinx.com:ip:clk_wiz:6.0 clk_wiz_1
set_property -dict [list \
  CONFIG.CLKOUT1_JITTER 217.614 \
  CONFIG.CLKOUT1_PHASE_ERROR 245.344 \
  CONFIG.CLKOUT1_REQUESTED_OUT_FREQ 148.5 \
  CONFIG.MMCM_CLKFBOUT_MULT_F 37.125 \
  CONFIG.MMCM_CLKOUT0_DIVIDE_F 6.250 \
  CONFIG.MMCM_DIVCLK_DIVIDE 4 \
  CONFIG.RESET_TYPE ACTIVE_HIGH \
  CONFIG.USE_PHASE_ALIGNMENT true \
] [get_bd_cells clk_wiz_1]
create_bd_cell -type ip -vlnv xilinx.com:ip:v_tc:6.2 v_tc_0
set_property -dict [list \
  CONFIG.HAS_AXI4_LITE false \
  CONFIG.HAS_INTC_IF false \
  CONFIG.VIDEO_MODE 1080p \
  CONFIG.enable_detection false \
  CONFIG.enable_generation true \
  CONFIG.max_clocks_per_line 4096 \
  CONFIG.max_lines_per_frame 4096 \
] [get_bd_cells v_tc_0]
create_bd_cell -type ip -vlnv xilinx.com:ip:v_tpg:8.0 v_tpg_0
set_property -dict {CONFIG.MAX_COLS 3840} [get_bd_cells v_tpg_0]
create_bd_cell -type ip -vlnv xilinx.com:ip:xlconstant:1.1 xlconstant_0
set_property -dict {CONFIG.CONST_VAL 0} [get_bd_cells xlconstant_0]
create_bd_cell -type ip -vlnv xilinx.com:ip:xlconstant:1.1 xlconstant_1

# ---- hierarchy /microblaze_0_local_memory ----
current_bd_instance /microblaze_0_local_memory
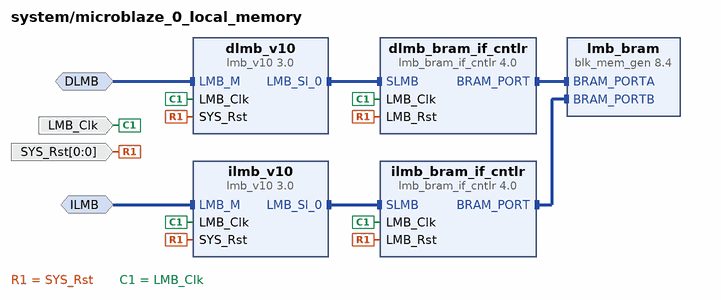
[diagram p7: block diagram inside /microblaze_0_local_memory]
create_bd_intf_pin -mode MirroredMaster -vlnv xilinx.com:interface:lmb_rtl:1.0 DLMB
create_bd_intf_pin -mode MirroredMaster -vlnv xilinx.com:interface:lmb_rtl:1.0 ILMB
create_bd_pin -dir I -type clk LMB_Clk
create_bd_pin -dir I -from 0 -to 0 -type rst SYS_Rst

create_bd_cell -type ip -vlnv xilinx.com:ip:lmb_bram_if_cntlr:4.0 dlmb_bram_if_cntlr
set_property -dict {CONFIG.C_ECC 0} [get_bd_cells dlmb_bram_if_cntlr]
create_bd_cell -type ip -vlnv xilinx.com:ip:lmb_v10:3.0 dlmb_v10
create_bd_cell -type ip -vlnv xilinx.com:ip:lmb_bram_if_cntlr:4.0 ilmb_bram_if_cntlr
set_property -dict {CONFIG.C_ECC 0} [get_bd_cells ilmb_bram_if_cntlr]
create_bd_cell -type ip -vlnv xilinx.com:ip:lmb_v10:3.0 ilmb_v10
create_bd_cell -type ip -vlnv xilinx.com:ip:blk_mem_gen:8.4 lmb_bram
set_property -dict [list \
  CONFIG.EN_SAFETY_CKT false \
  CONFIG.Enable_B Use_ENB_Pin \
  CONFIG.Memory_Type True_Dual_Port_RAM \
  CONFIG.Port_B_Clock 100 \
  CONFIG.Port_B_Enable_Rate 100 \
  CONFIG.Port_B_Write_Rate 50 \
  CONFIG.Use_RSTB_Pin true \
  CONFIG.use_bram_block BRAM_Controller \
] [get_bd_cells lmb_bram]

# ---- connections ----

current_bd_instance /CLOCK_COUNTER
connect_bd_intf_net [get_bd_intf_pins FMC_HPC_GBTCLK1_gpio/S_AXI] [get_bd_intf_pins axi_interconnect_0/M12_AXI]
connect_bd_intf_net [get_bd_intf_pins FMC_HPC_CLK1_gpio/S_AXI] [get_bd_intf_pins axi_interconnect_0/M05_AXI]
connect_bd_intf_net [get_bd_intf_pins FMC_LPC_CLK1_gpio/S_AXI] [get_bd_intf_pins axi_interconnect_0/M02_AXI]
connect_bd_intf_net [get_bd_intf_pins SMA_MGT_REFCLK_gpio/S_AXI] [get_bd_intf_pins axi_interconnect_0/M07_AXI]
connect_bd_intf_net [get_bd_intf_pins CLK_125MHZ_gpio/S_AXI] [get_bd_intf_pins axi_interconnect_0/M10_AXI]
connect_bd_intf_net [get_bd_intf_pins FMC_LPC_CLK0_gpio/S_AXI] [get_bd_intf_pins axi_interconnect_0/M03_AXI]
connect_bd_intf_net [get_bd_intf_pins MGT_SI570_CLOCK_gpio/S_AXI] [get_bd_intf_pins axi_interconnect_0/M08_AXI]
connect_bd_intf_net [get_bd_intf_pins FMC_HPC_CLK0_gpio/S_AXI] [get_bd_intf_pins axi_interconnect_0/M06_AXI]
connect_bd_intf_net [get_bd_intf_pins S00_AXI] [get_bd_intf_pins axi_interconnect_0/S00_AXI]
connect_bd_intf_net [get_bd_intf_pins SYSCLK300_gpio/S_AXI] [get_bd_intf_pins axi_interconnect_0/M04_AXI]
connect_bd_intf_net [get_bd_intf_pins FMC_HPC_GBTCLK0_gpio/S_AXI] [get_bd_intf_pins axi_interconnect_0/M11_AXI]
connect_bd_intf_net [get_bd_intf_pins FMC_LPC_GBTCLK0_gpio/S_AXI] [get_bd_intf_pins axi_interconnect_0/M09_AXI]
connect_bd_intf_net [get_bd_intf_pins USER_SI570_CLOCK_gpio/S_AXI] [get_bd_intf_pins axi_interconnect_0/M00_AXI]
connect_bd_intf_net [get_bd_intf_pins EMCCLK_gpio/S_AXI] [get_bd_intf_pins axi_interconnect_0/M13_AXI]
connect_bd_intf_net [get_bd_intf_pins SI5328_OUT_gpio/S_AXI] [get_bd_intf_pins axi_interconnect_0/M01_AXI]
connect_bd_net [get_bd_pins ARESETN] [get_bd_pins axi_interconnect_0/ARESETN]
connect_bd_net [get_bd_pins CLKIN] [get_bd_pins SYSCLK300_ctr/CLKIN]
connect_bd_net -net CLK_125MHZ_FREQ_CNT_O [get_bd_pins CLK_125MHZ_ctr/FREQ_CNT_O] [get_bd_pins CLK_125MHZ_gpio/gpio_io_i]
connect_bd_net -net CPU_RESET_1 [get_bd_pins RST_I] \
  [get_bd_pins CLK_125MHZ_ctr/RST_I] [get_bd_pins EMCCLK_ctr/RST_I] [get_bd_pins FMC_HPC_CLK0_ctr/RST_I] \
  [get_bd_pins FMC_HPC_CLK1_ctr/RST_I] [get_bd_pins FMC_HPC_GBTCLK0_ctr/RST_I] [get_bd_pins FMC_HPC_GBTCLK1_ctr/RST_I] \
  [get_bd_pins FMC_LPC_CLK0_ctr/RST_I] [get_bd_pins FMC_LPC_CLK1_ctr/RST_I] [get_bd_pins FMC_LPC_GBTCLK0_ctr2/RST_I] \
  [get_bd_pins MGT_SI570_CLOCK_ctr/RST_I] [get_bd_pins SI5328_OUT_ctr/RST_I] [get_bd_pins SMA_MGT_REFCLK_ctr1/RST_I] \
  [get_bd_pins SYSCLK300_ctr/RST_I] [get_bd_pins USER_SI570_CLOCK_ctr/RST_I] [get_bd_pins clk_wiz_0/reset]
connect_bd_net -net DIFF_CLKIN_N_1 [get_bd_pins CLK_125MHZ_N] [get_bd_pins CLK_125MHZ_ctr/DIFF_CLKIN_N]
connect_bd_net -net DIFF_CLKIN_N_2 [get_bd_pins USER_SI570_CLOCK_N] [get_bd_pins USER_SI570_CLOCK_ctr/DIFF_CLKIN_N]
connect_bd_net -net DIFF_CLKIN_N_3 [get_bd_pins FMC_HPC_CLK0_N] [get_bd_pins FMC_HPC_CLK0_ctr/DIFF_CLKIN_N]
connect_bd_net -net DIFF_CLKIN_N_4 [get_bd_pins FMC_HPC_CLK1_N] [get_bd_pins FMC_HPC_CLK1_ctr/DIFF_CLKIN_N]
connect_bd_net -net DIFF_CLKIN_N_5 [get_bd_pins FMC_LPC_CLK0_N] [get_bd_pins FMC_LPC_CLK0_ctr/DIFF_CLKIN_N]
connect_bd_net -net DIFF_CLKIN_N_6 [get_bd_pins FMC_LPC_CLK1_N] [get_bd_pins FMC_LPC_CLK1_ctr/DIFF_CLKIN_N]
connect_bd_net -net DIFF_CLKIN_P_1 [get_bd_pins CLK_125MHZ_P] [get_bd_pins CLK_125MHZ_ctr/DIFF_CLKIN_P]
connect_bd_net -net DIFF_CLKIN_P_2 [get_bd_pins USER_SI570_CLOCK_P] [get_bd_pins USER_SI570_CLOCK_ctr/DIFF_CLKIN_P]
connect_bd_net -net DIFF_CLKIN_P_3 [get_bd_pins FMC_HPC_CLK0_P] [get_bd_pins FMC_HPC_CLK0_ctr/DIFF_CLKIN_P]
connect_bd_net -net DIFF_CLKIN_P_4 [get_bd_pins FMC_HPC_CLK1_P] [get_bd_pins FMC_HPC_CLK1_ctr/DIFF_CLKIN_P]
connect_bd_net -net DIFF_CLKIN_P_5 [get_bd_pins FMC_LPC_CLK0_P] [get_bd_pins FMC_LPC_CLK0_ctr/DIFF_CLKIN_P]
connect_bd_net -net DIFF_CLKIN_P_6 [get_bd_pins FMC_LPC_CLK1_P] [get_bd_pins FMC_LPC_CLK1_ctr/DIFF_CLKIN_P]
connect_bd_net -net DIFF_MGTE3_N_2 [get_bd_pins FMC_LPC_GBTCLK0_N] [get_bd_pins FMC_LPC_GBTCLK0_ctr2/DIFF_MGTE3_N]
connect_bd_net -net DIFF_MGTE3_N_3 [get_bd_pins FMC_HPC_GBTCLK0_N] [get_bd_pins FMC_HPC_GBTCLK0_ctr/DIFF_MGTE3_N]
connect_bd_net -net DIFF_MGTE3_N_4 [get_bd_pins FMC_HPC_GBTCLK1_N] [get_bd_pins FMC_HPC_GBTCLK1_ctr/DIFF_MGTE3_N]
connect_bd_net -net DIFF_MGTE3_N_5 [get_bd_pins SMA_MGT_REFCLK_N] [get_bd_pins SMA_MGT_REFCLK_ctr1/DIFF_MGTE3_N]
connect_bd_net -net DIFF_MGTE3_N_6 [get_bd_pins MGT_SI570_CLOCK_N] [get_bd_pins MGT_SI570_CLOCK_ctr/DIFF_MGTE3_N]
connect_bd_net -net DIFF_MGTE3_N_7 [get_bd_pins SI5328_OUT_N] [get_bd_pins SI5328_OUT_ctr/DIFF_MGTE3_N]
connect_bd_net -net DIFF_MGTE3_P_2 [get_bd_pins FMC_LPC_GBTCLK0_P] [get_bd_pins FMC_LPC_GBTCLK0_ctr2/DIFF_MGTE3_P]
connect_bd_net -net DIFF_MGTE3_P_3 [get_bd_pins FMC_HPC_GBTCLK0_P] [get_bd_pins FMC_HPC_GBTCLK0_ctr/DIFF_MGTE3_P]
connect_bd_net -net DIFF_MGTE3_P_4 [get_bd_pins FMC_HPC_GBTCLK1_P] [get_bd_pins FMC_HPC_GBTCLK1_ctr/DIFF_MGTE3_P]
connect_bd_net -net DIFF_MGTE3_P_5 [get_bd_pins SMA_MGT_REFCLK_P] [get_bd_pins SMA_MGT_REFCLK_ctr1/DIFF_MGTE3_P]
connect_bd_net -net DIFF_MGTE3_P_6 [get_bd_pins MGT_SI570_CLOCK_P] [get_bd_pins MGT_SI570_CLOCK_ctr/DIFF_MGTE3_P]
connect_bd_net -net DIFF_MGTE3_P_7 [get_bd_pins SI5328_OUT_P] [get_bd_pins SI5328_OUT_ctr/DIFF_MGTE3_P]
connect_bd_net [get_bd_pins EMCCLK] [get_bd_pins EMCCLK_ctr/CLKIN]
connect_bd_net [get_bd_pins EMCCLK_ctr/FREQ_CNT_O] [get_bd_pins EMCCLK_gpio/gpio_io_i]
connect_bd_net [get_bd_pins FMC_HPC_CLK0_ctr/FREQ_CNT_O] [get_bd_pins FMC_HPC_CLK0_gpio/gpio_io_i]
connect_bd_net [get_bd_pins FMC_HPC_CLK1_ctr/FREQ_CNT_O] [get_bd_pins FMC_HPC_CLK1_gpio/gpio_io_i]
connect_bd_net [get_bd_pins FMC_HPC_GBTCLK0_ctr/FREQ_CNT_O] [get_bd_pins FMC_HPC_GBTCLK0_gpio/gpio_io_i]
connect_bd_net [get_bd_pins FMC_HPC_GBTCLK1_ctr/FREQ_CNT_O] [get_bd_pins FMC_HPC_GBTCLK1_gpio/gpio_io_i]
connect_bd_net [get_bd_pins FMC_LPC_CLK0_ctr/FREQ_CNT_O] [get_bd_pins FMC_LPC_CLK0_gpio/gpio_io_i]
connect_bd_net [get_bd_pins FMC_LPC_CLK1_ctr/FREQ_CNT_O] [get_bd_pins FMC_LPC_CLK1_gpio/gpio_io_i]
connect_bd_net [get_bd_pins FMC_LPC_GBTCLK0_ctr2/FREQ_CNT_O] [get_bd_pins FMC_LPC_GBTCLK0_gpio/gpio_io_i]
connect_bd_net [get_bd_pins MGT_SI570_CLOCK_ctr/FREQ_CNT_O] [get_bd_pins MGT_SI570_CLOCK_gpio/gpio_io_i]
connect_bd_net [get_bd_pins SI5328_OUT_ctr/FREQ_CNT_O] [get_bd_pins SI5328_OUT_gpio/gpio_io_i]
connect_bd_net [get_bd_pins SMA_MGT_REFCLK_ctr1/FREQ_CNT_O] [get_bd_pins SMA_MGT_REFCLK_gpio/gpio_io_i]
connect_bd_net -net SYSCLK300_FREQ_CNT_O [get_bd_pins SYSCLK300_ctr/FREQ_CNT_O] [get_bd_pins SYSCLK300_gpio/gpio_io_i]
connect_bd_net [get_bd_pins USER_SI570_CLOCK_ctr/FREQ_CNT_O] [get_bd_pins USER_SI570_CLOCK_gpio/gpio_io_i]
connect_bd_net [get_bd_pins clk_wiz_0/clk_out1] [get_bd_pins REC_CLOCK_OUT/OBUF_IN] [get_bd_pins USER_SMA_CLOCK_OUT/OBUF_IN]
connect_bd_net -net clk_wiz_0_clk_out2 [get_bd_pins REF_CLK_I] \
  [get_bd_pins CLK_125MHZ_ctr/REF_CLK_I] [get_bd_pins EMCCLK_ctr/REF_CLK_I] [get_bd_pins FMC_HPC_CLK0_ctr/REF_CLK_I] \
  [get_bd_pins FMC_HPC_CLK1_ctr/REF_CLK_I] [get_bd_pins FMC_HPC_GBTCLK0_ctr/REF_CLK_I] \
  [get_bd_pins FMC_HPC_GBTCLK1_ctr/REF_CLK_I] [get_bd_pins FMC_LPC_CLK0_ctr/REF_CLK_I] \
  [get_bd_pins FMC_LPC_CLK1_ctr/REF_CLK_I] [get_bd_pins FMC_LPC_GBTCLK0_ctr2/REF_CLK_I] \
  [get_bd_pins MGT_SI570_CLOCK_ctr/REF_CLK_I] [get_bd_pins SI5328_OUT_ctr/REF_CLK_I] \
  [get_bd_pins SMA_MGT_REFCLK_ctr1/REF_CLK_I] [get_bd_pins SYSCLK300_ctr/REF_CLK_I] \
  [get_bd_pins USER_SI570_CLOCK_ctr/REF_CLK_I] [get_bd_pins clk_wiz_0/clk_in1]
connect_bd_net [get_bd_pins s_axi_aclk] \
  [get_bd_pins CLK_125MHZ_gpio/s_axi_aclk] [get_bd_pins EMCCLK_gpio/s_axi_aclk] [get_bd_pins FMC_HPC_CLK0_gpio/s_axi_aclk] \
  [get_bd_pins FMC_HPC_CLK1_gpio/s_axi_aclk] [get_bd_pins FMC_HPC_GBTCLK0_gpio/s_axi_aclk] \
  [get_bd_pins FMC_HPC_GBTCLK1_gpio/s_axi_aclk] [get_bd_pins FMC_LPC_CLK0_gpio/s_axi_aclk] \
  [get_bd_pins FMC_LPC_CLK1_gpio/s_axi_aclk] [get_bd_pins FMC_LPC_GBTCLK0_gpio/s_axi_aclk] \
  [get_bd_pins MGT_SI570_CLOCK_gpio/s_axi_aclk] [get_bd_pins SI5328_OUT_gpio/s_axi_aclk] \
  [get_bd_pins SMA_MGT_REFCLK_gpio/s_axi_aclk] [get_bd_pins SYSCLK300_gpio/s_axi_aclk] \
  [get_bd_pins USER_SI570_CLOCK_gpio/s_axi_aclk] [get_bd_pins axi_interconnect_0/ACLK] \
  [get_bd_pins axi_interconnect_0/S00_ACLK] [get_bd_pins axi_interconnect_0/M00_ACLK] \
  [get_bd_pins axi_interconnect_0/M01_ACLK] [get_bd_pins axi_interconnect_0/M02_ACLK] \
  [get_bd_pins axi_interconnect_0/M03_ACLK] [get_bd_pins axi_interconnect_0/M04_ACLK] \
  [get_bd_pins axi_interconnect_0/M05_ACLK] [get_bd_pins axi_interconnect_0/M06_ACLK] \
  [get_bd_pins axi_interconnect_0/M07_ACLK] [get_bd_pins axi_interconnect_0/M08_ACLK] \
  [get_bd_pins axi_interconnect_0/M09_ACLK] [get_bd_pins axi_interconnect_0/M10_ACLK] \
  [get_bd_pins axi_interconnect_0/M11_ACLK] [get_bd_pins axi_interconnect_0/M12_ACLK] \
  [get_bd_pins axi_interconnect_0/M13_ACLK]
connect_bd_net [get_bd_pins s_axi_aresetn] \
  [get_bd_pins CLK_125MHZ_gpio/s_axi_aresetn] [get_bd_pins EMCCLK_gpio/s_axi_aresetn] \
  [get_bd_pins FMC_HPC_CLK0_gpio/s_axi_aresetn] [get_bd_pins FMC_HPC_CLK1_gpio/s_axi_aresetn] \
  [get_bd_pins FMC_HPC_GBTCLK0_gpio/s_axi_aresetn] [get_bd_pins FMC_HPC_GBTCLK1_gpio/s_axi_aresetn] \
  [get_bd_pins FMC_LPC_CLK0_gpio/s_axi_aresetn] [get_bd_pins FMC_LPC_CLK1_gpio/s_axi_aresetn] \
  [get_bd_pins FMC_LPC_GBTCLK0_gpio/s_axi_aresetn] [get_bd_pins MGT_SI570_CLOCK_gpio/s_axi_aresetn] \
  [get_bd_pins SI5328_OUT_gpio/s_axi_aresetn] [get_bd_pins SMA_MGT_REFCLK_gpio/s_axi_aresetn] \
  [get_bd_pins SYSCLK300_gpio/s_axi_aresetn] [get_bd_pins USER_SI570_CLOCK_gpio/s_axi_aresetn] \
  [get_bd_pins axi_interconnect_0/S00_ARESETN] [get_bd_pins axi_interconnect_0/M00_ARESETN] \
  [get_bd_pins axi_interconnect_0/M01_ARESETN] [get_bd_pins axi_interconnect_0/M02_ARESETN] \
  [get_bd_pins axi_interconnect_0/M03_ARESETN] [get_bd_pins axi_interconnect_0/M04_ARESETN] \
  [get_bd_pins axi_interconnect_0/M05_ARESETN] [get_bd_pins axi_interconnect_0/M06_ARESETN] \
  [get_bd_pins axi_interconnect_0/M07_ARESETN] [get_bd_pins axi_interconnect_0/M08_ARESETN] \
  [get_bd_pins axi_interconnect_0/M09_ARESETN] [get_bd_pins axi_interconnect_0/M10_ARESETN] \
  [get_bd_pins axi_interconnect_0/M11_ARESETN] [get_bd_pins axi_interconnect_0/M12_ARESETN] \
  [get_bd_pins axi_interconnect_0/M13_ARESETN]
connect_bd_net -net util_ds_buf_0_OBUF_DS_N [get_bd_pins REC_CLOCK_OUT/OBUF_DS_N] [get_bd_pins REC_CLOCK_N]
connect_bd_net -net util_ds_buf_0_OBUF_DS_P [get_bd_pins REC_CLOCK_OUT/OBUF_DS_P] [get_bd_pins REC_CLOCK_P]
connect_bd_net -net util_ds_buf_1_OBUF_DS_N [get_bd_pins USER_SMA_CLOCK_OUT/OBUF_DS_N] [get_bd_pins USER_SMA_CLOCK_N]
connect_bd_net -net util_ds_buf_1_OBUF_DS_P [get_bd_pins USER_SMA_CLOCK_OUT/OBUF_DS_P] [get_bd_pins USER_SMA_CLOCK_P]

current_bd_instance /colorbar_tpg_hier_0
connect_bd_intf_net [get_bd_intf_pins s_axi_CTRL] [get_bd_intf_pins v_tpg_0/s_axi_CTRL]
connect_bd_intf_net [get_bd_intf_pins vid_io_out] [get_bd_intf_pins v_axi4s_vid_out_0/vid_io_out]
connect_bd_intf_net [get_bd_intf_pins axis_subset_converter_0/S_AXIS] [get_bd_intf_pins v_tpg_0/m_axis_video]
connect_bd_intf_net [get_bd_intf_pins v_axi4s_vid_out_0/vtiming_in] [get_bd_intf_pins v_tc_0/vtiming_out]
connect_bd_intf_net [get_bd_intf_pins axis_subset_converter_0/M_AXIS] [get_bd_intf_pins v_axi4s_vid_out_0/video_in]
connect_bd_net -net clk_in1_1 [get_bd_pins clk_in1] [get_bd_pins clk_wiz_1/clk_in1]
connect_bd_net [get_bd_pins clk_wiz_1/clk_out1] \
  [get_bd_pins clk_out1] [get_bd_pins top_oddr_0_0/CLK] [get_bd_pins proc_sys_reset_0/slowest_sync_clk] \
  [get_bd_pins v_axi4s_vid_out_0/aclk] [get_bd_pins v_axi4s_vid_out_0/vid_io_out_clk] \
  [get_bd_pins axis_subset_converter_0/aclk] [get_bd_pins v_tc_0/clk] [get_bd_pins v_tpg_0/ap_clk]
connect_bd_net [get_bd_pins clk_wiz_1/locked] [get_bd_pins proc_sys_reset_0/ext_reset_in] [get_bd_pins proc_sys_reset_0/dcm_locked]
connect_bd_net [get_bd_pins proc_sys_reset_0/interconnect_aresetn] [get_bd_pins interconnect_aresetn]
connect_bd_net [get_bd_pins proc_sys_reset_0/peripheral_aresetn] \
  [get_bd_pins v_axi4s_vid_out_0/aresetn] [get_bd_pins axis_subset_converter_0/aresetn] [get_bd_pins v_tc_0/resetn] \
  [get_bd_pins v_tpg_0/ap_rst_n]
connect_bd_net [get_bd_pins reset] [get_bd_pins clk_wiz_1/reset]
connect_bd_net [get_bd_pins top_oddr_0_0/Q] [get_bd_pins vid_clk_148_5MHz_out]
connect_bd_net [get_bd_pins v_axi4s_vid_out_0/vtg_ce] [get_bd_pins v_tc_0/gen_clken]
connect_bd_net -net xlconstant_0_const [get_bd_pins xlconstant_0/dout] \
  [get_bd_pins top_oddr_0_0/D1] [get_bd_pins top_oddr_0_0/SR] [get_bd_pins v_axi4s_vid_out_0/fid] \
  [get_bd_pins v_axi4s_vid_out_0/vid_io_out_reset]
connect_bd_net -net xlconstant_1_const [get_bd_pins xlconstant_1/dout] \
  [get_bd_pins top_oddr_0_0/D2] [get_bd_pins v_axi4s_vid_out_0/aclken] [get_bd_pins v_axi4s_vid_out_0/vid_io_out_ce] \
  [get_bd_pins v_tc_0/clken]

current_bd_instance /microblaze_0_local_memory
connect_bd_intf_net -intf_net microblaze_0_ilmb [get_bd_intf_pins ILMB] [get_bd_intf_pins ilmb_v10/LMB_M]
connect_bd_intf_net -intf_net microblaze_0_dlmb_bus [get_bd_intf_pins dlmb_bram_if_cntlr/SLMB] [get_bd_intf_pins dlmb_v10/LMB_Sl_0]
connect_bd_intf_net -intf_net microblaze_0_dlmb_cntlr [get_bd_intf_pins dlmb_bram_if_cntlr/BRAM_PORT] [get_bd_intf_pins lmb_bram/BRAM_PORTA]
connect_bd_intf_net -intf_net microblaze_0_ilmb_cntlr [get_bd_intf_pins ilmb_bram_if_cntlr/BRAM_PORT] [get_bd_intf_pins lmb_bram/BRAM_PORTB]
connect_bd_intf_net -intf_net microblaze_0_ilmb_bus [get_bd_intf_pins ilmb_bram_if_cntlr/SLMB] [get_bd_intf_pins ilmb_v10/LMB_Sl_0]
connect_bd_intf_net -intf_net microblaze_0_dlmb [get_bd_intf_pins DLMB] [get_bd_intf_pins dlmb_v10/LMB_M]
connect_bd_net [get_bd_pins SYS_Rst] \
  [get_bd_pins dlmb_bram_if_cntlr/LMB_Rst] [get_bd_pins dlmb_v10/SYS_Rst] [get_bd_pins ilmb_bram_if_cntlr/LMB_Rst] \
  [get_bd_pins ilmb_v10/SYS_Rst]
connect_bd_net -net microblaze_0_Clk [get_bd_pins LMB_Clk] \
  [get_bd_pins dlmb_bram_if_cntlr/LMB_Clk] [get_bd_pins dlmb_v10/LMB_Clk] [get_bd_pins ilmb_bram_if_cntlr/LMB_Clk] \
  [get_bd_pins ilmb_v10/LMB_Clk]
set_property HDL_ATTRIBUTE.BMM_INFO_ADDRESS_SPACE {byte  0x00000000 32 > system microblaze_0_local_memory/lmb_bram} [get_bd_cells dlmb_bram_if_cntlr]
set_property HDL_ATTRIBUTE.KEEP_HIERARCHY yes [get_bd_cells dlmb_bram_if_cntlr]

current_bd_instance /
connect_bd_intf_net [get_bd_intf_pins PMOD_IN/S_AXI] [get_bd_intf_pins microblaze_0_axi_periph/M17_AXI]
connect_bd_intf_net [get_bd_intf_pins microblaze_0/DLMB] [get_bd_intf_pins microblaze_0_local_memory/DLMB]
connect_bd_intf_net [get_bd_intf_pins microblaze_0_axi_intc/s_axi] [get_bd_intf_pins microblaze_0_axi_periph/M12_AXI]
connect_bd_intf_net [get_bd_intf_pins axi_timer_0/S_AXI] [get_bd_intf_pins microblaze_0_axi_periph/M07_AXI]
connect_bd_intf_net [get_bd_intf_pins microblaze_0_axi_periph/M24_AXI] [get_bd_intf_pins axi_bram_ctrl_2/S_AXI]
connect_bd_intf_net [get_bd_intf_pins axi_mem_intercon/S05_AXI] [get_bd_intf_pins xdma_0/M_AXI]
connect_bd_intf_net [get_bd_intf_ports qspi1] [get_bd_intf_pins axi_quad_spi_0/SPI_0]
connect_bd_intf_net -intf_net Vaux8_1 [get_bd_intf_ports Vaux8] [get_bd_intf_pins system_management_wiz_0/Vaux8]
connect_bd_intf_net [get_bd_intf_pins led_8bits/S_AXI] [get_bd_intf_pins microblaze_0_axi_periph/M22_AXI]
connect_bd_intf_net [get_bd_intf_pins axi_iic_0/S_AXI] [get_bd_intf_pins microblaze_0_axi_periph/M05_AXI]
connect_bd_intf_net [get_bd_intf_pins axi_ethernet_0/m_axis_rxd] [get_bd_intf_pins axi_ethernet_0_dma/S_AXIS_S2MM]
connect_bd_intf_net [get_bd_intf_pins SI570_CLK_SEL1/S_AXI] [get_bd_intf_pins microblaze_0_axi_periph/M13_AXI]
connect_bd_intf_net [get_bd_intf_pins CLOCK_COUNTER/S00_AXI] [get_bd_intf_pins smartconnect_0/M01_AXI]
connect_bd_intf_net [get_bd_intf_pins GPIO_OUT_HPC_LA_BUS/S_AXI] [get_bd_intf_pins microblaze_0_axi_periph/M03_AXI]
connect_bd_intf_net -intf_net BRAM_PORTB_0_1 [get_bd_intf_ports BRAM_PORTB_0] [get_bd_intf_pins axi_bram_ctrl_0_bram1/BRAM_PORTB]
connect_bd_intf_net [get_bd_intf_ports BRAM_PORTB_0] [get_bd_intf_pins system_ila_0/SLOT_1_BRAM]
connect_bd_intf_net [get_bd_intf_pins mdm_1/MBDEBUG_0] [get_bd_intf_pins microblaze_0/DEBUG]
connect_bd_intf_net [get_bd_intf_pins axi_quad_spi_0/AXI_LITE] [get_bd_intf_pins microblaze_0_axi_periph/M06_AXI]
connect_bd_intf_net [get_bd_intf_pins USER_SMA_GPIO_IN1/S_AXI] [get_bd_intf_pins microblaze_0_axi_periph/M15_AXI]
connect_bd_intf_net [get_bd_intf_ports vid_io_out] [get_bd_intf_pins colorbar_tpg_hier_0/vid_io_out]
connect_bd_intf_net [get_bd_intf_pins axi_mem_intercon/S00_AXI] [get_bd_intf_pins microblaze_0/M_AXI_DC]
connect_bd_intf_net [get_bd_intf_pins colorbar_tpg_hier_0/s_axi_CTRL] [get_bd_intf_pins microblaze_0_axi_periph/M23_AXI]
connect_bd_intf_net [get_bd_intf_pins microblaze_0_axi_periph/M18_AXI] [get_bd_intf_pins system_management_wiz_0/S_AXI_LITE]
connect_bd_intf_net -intf_net axi_gpio_0_GPIO1 [get_bd_intf_ports led_8bits] [get_bd_intf_pins led_8bits/GPIO]
connect_bd_intf_net [get_bd_intf_ports sgmii_phyclk] [get_bd_intf_pins axi_ethernet_0/lvds_clk]
connect_bd_intf_net [get_bd_intf_pins axi_ethernet_0_dma/M_AXI_S2MM] [get_bd_intf_pins axi_mem_intercon/S04_AXI]
connect_bd_intf_net [get_bd_intf_pins axi_ethernet_0/s_axi] [get_bd_intf_pins microblaze_0_axi_periph/M09_AXI]
connect_bd_intf_net [get_bd_intf_pins GPIO_OUT_LPC_LA_BUS/S_AXI] [get_bd_intf_pins microblaze_0_axi_periph/M04_AXI]
connect_bd_intf_net [get_bd_intf_pins microblaze_0/M_AXI_DP] [get_bd_intf_pins smartconnect_0/S00_AXI]
connect_bd_intf_net [get_bd_intf_ports Vp_Vn] [get_bd_intf_pins system_management_wiz_0/Vp_Vn]
connect_bd_intf_net [get_bd_intf_pins axi_mem_intercon/S01_AXI] [get_bd_intf_pins microblaze_0/M_AXI_IC]
connect_bd_intf_net [get_bd_intf_ports iic_main] [get_bd_intf_pins axi_iic_0/IIC]
connect_bd_intf_net [get_bd_intf_pins axi_bram_ctrl_0/BRAM_PORTA] [get_bd_intf_pins axi_bram_ctrl_0_bram/BRAM_PORTA]
connect_bd_intf_net [get_bd_intf_pins axi_ethernet_0_dma/M_AXI_SG] [get_bd_intf_pins axi_mem_intercon/S02_AXI]
connect_bd_intf_net [get_bd_intf_ports ddr4_sdram] [get_bd_intf_pins ddr4_0/C0_DDR4]
connect_bd_intf_net -intf_net axi_gpio_0_GPIO [get_bd_intf_ports dip_switches_4bits] [get_bd_intf_pins dip_switches_4bits/GPIO]
connect_bd_intf_net [get_bd_intf_pins GPIO_IN_HPC_LA_BUS/S_AXI] [get_bd_intf_pins microblaze_0_axi_periph/M01_AXI]
connect_bd_intf_net [get_bd_intf_pins USER_SMA_GPIO_OUT1/S_AXI] [get_bd_intf_pins microblaze_0_axi_periph/M14_AXI]
connect_bd_intf_net [get_bd_intf_ports pci_express_x8] [get_bd_intf_pins xdma_0/pcie_mgt]
connect_bd_intf_net [get_bd_intf_pins GPIO_IN_LPC_LA_BUS/S_AXI] [get_bd_intf_pins microblaze_0_axi_periph/M02_AXI]
connect_bd_intf_net [get_bd_intf_pins microblaze_0_axi_periph/M21_AXI] [get_bd_intf_pins push_buttons_5bits/S_AXI]
connect_bd_intf_net [get_bd_intf_ports pcie_refclk] [get_bd_intf_pins util_ds_buf_0/CLK_IN_D]
connect_bd_intf_net [get_bd_intf_pins axi_mem_intercon/M01_AXI] [get_bd_intf_pins ddr4_0/C0_DDR4_S_AXI]
connect_bd_intf_net [get_bd_intf_pins smartconnect_0/M00_AXI] [get_bd_intf_pins microblaze_0_axi_periph/S00_AXI]
connect_bd_intf_net [get_bd_intf_pins axi_bram_ctrl_0/BRAM_PORTB] [get_bd_intf_pins axi_bram_ctrl_0_bram/BRAM_PORTB]
connect_bd_intf_net [get_bd_intf_pins axi_mem_intercon/S06_AXI] [get_bd_intf_pins xdma_0/M_AXI_LITE]
connect_bd_intf_net [get_bd_intf_pins axi_ethernet_0/m_axis_rxs] [get_bd_intf_pins axi_ethernet_0_dma/S_AXIS_STS]
connect_bd_intf_net -intf_net Vaux2_1 [get_bd_intf_ports Vaux2] [get_bd_intf_pins system_management_wiz_0/Vaux2]
connect_bd_intf_net [get_bd_intf_pins axi_ethernet_0/s_axis_txd] [get_bd_intf_pins axi_ethernet_0_dma/M_AXIS_MM2S]
connect_bd_intf_net [get_bd_intf_pins mdm_1/S_AXI] [get_bd_intf_pins microblaze_0_axi_periph/M11_AXI]
connect_bd_intf_net [get_bd_intf_pins axi_bram_ctrl_0/S_AXI] [get_bd_intf_pins axi_mem_intercon/M00_AXI]
connect_bd_intf_net -intf_net axi_gpio_0_GPIO2 [get_bd_intf_ports push_buttons_5bits] [get_bd_intf_pins push_buttons_5bits/GPIO]
connect_bd_intf_net [get_bd_intf_pins microblaze_0/ILMB] [get_bd_intf_pins microblaze_0_local_memory/ILMB]
connect_bd_intf_net [get_bd_intf_ports rs232_uart] [get_bd_intf_pins axi_uart16550_0/UART]
connect_bd_intf_net [get_bd_intf_pins microblaze_0/INTERRUPT] [get_bd_intf_pins microblaze_0_axi_intc/interrupt]
connect_bd_intf_net [get_bd_intf_pins axi_ethernet_0/s_axis_txc] [get_bd_intf_pins axi_ethernet_0_dma/M_AXIS_CNTRL]
connect_bd_intf_net [get_bd_intf_pins axi_ethernet_0_dma/M_AXI_MM2S] [get_bd_intf_pins axi_mem_intercon/S03_AXI]
connect_bd_intf_net [get_bd_intf_pins axi_bram_ctrl_1/BRAM_PORTA] [get_bd_intf_pins axi_bram_ctrl_0_bram1/BRAM_PORTA]
connect_bd_intf_net -intf_net USER_SMA_GPIO_IN_GPIO [get_bd_intf_ports USER_SMA_GPIO_IN] [get_bd_intf_pins USER_SMA_GPIO_IN1/GPIO]
connect_bd_intf_net [get_bd_intf_ports SI570_CLK_SEL] [get_bd_intf_pins SI570_CLK_SEL1/GPIO]
connect_bd_intf_net [get_bd_intf_ports mdio_mdc] [get_bd_intf_pins axi_ethernet_0/mdio]
connect_bd_intf_net -intf_net USER_SMA_GPIO_OUT_GPIO [get_bd_intf_ports USER_SMA_GPIO_OUT] [get_bd_intf_pins USER_SMA_GPIO_OUT1/GPIO]
connect_bd_intf_net [get_bd_intf_ports PMOD_IN] [get_bd_intf_pins PMOD_IN/GPIO]
connect_bd_intf_net -intf_net Vaux0_1 [get_bd_intf_ports Vaux0] [get_bd_intf_pins system_management_wiz_0/Vaux0]
connect_bd_intf_net -intf_net default_sysclk_300_1 [get_bd_intf_ports default_sysclk_300] [get_bd_intf_pins ddr4_0/C0_SYS_CLK]
connect_bd_intf_net [get_bd_intf_pins microblaze_0_axi_periph/M20_AXI] [get_bd_intf_pins axi_bram_ctrl_1/S_AXI]
connect_bd_intf_net [get_bd_intf_ports sgmii_lvds] [get_bd_intf_pins axi_ethernet_0/sgmii]
connect_bd_intf_net [get_bd_intf_pins PMOD_OUT/S_AXI] [get_bd_intf_pins microblaze_0_axi_periph/M16_AXI]
connect_bd_intf_net [get_bd_intf_pins dip_switches_4bits/S_AXI] [get_bd_intf_pins microblaze_0_axi_periph/M19_AXI]
connect_bd_intf_net [get_bd_intf_pins axi_uart16550_0/S_AXI] [get_bd_intf_pins microblaze_0_axi_periph/M08_AXI]
connect_bd_intf_net [get_bd_intf_pins axi_bram_ctrl_2/BRAM_PORTA] [get_bd_intf_pins axi_bram_ctrl_0_bram2/BRAM_PORTA]
connect_bd_intf_net [get_bd_intf_pins axi_bram_ctrl_2/BRAM_PORTA] [get_bd_intf_pins system_ila_0/SLOT_0_BRAM]
connect_bd_intf_net [get_bd_intf_ports PMOD_OUT] [get_bd_intf_pins PMOD_OUT/GPIO]
connect_bd_intf_net [get_bd_intf_pins axi_ethernet_0_dma/S_AXI_LITE] [get_bd_intf_pins microblaze_0_axi_periph/M10_AXI]
connect_bd_intf_net [get_bd_intf_pins axi_bram_ctrl_0_bram2/BRAM_PORTB] [get_bd_intf_pins axi_bram_ctrl_2/BRAM_PORTB]
connect_bd_net -net CLOCK_COUNTER_OBUF_DS_N [get_bd_pins CLOCK_COUNTER/REC_CLOCK_N] [get_bd_ports REC_CLOCK_N]
connect_bd_net -net CLOCK_COUNTER_OBUF_DS_N1 [get_bd_pins CLOCK_COUNTER/USER_SMA_CLOCK_N] [get_bd_ports USER_SMA_CLOCK_N]
connect_bd_net -net CLOCK_COUNTER_OBUF_DS_P [get_bd_pins CLOCK_COUNTER/REC_CLOCK_P] [get_bd_ports REC_CLOCK_P]
connect_bd_net -net CLOCK_COUNTER_OBUF_DS_P1 [get_bd_pins CLOCK_COUNTER/USER_SMA_CLOCK_P] [get_bd_ports USER_SMA_CLOCK_P]
connect_bd_net -net DIFF_CLKIN_N_1 [get_bd_ports CLK_125MHZ_N] [get_bd_pins CLOCK_COUNTER/CLK_125MHZ_N]
connect_bd_net -net DIFF_CLKIN_N_1_1 [get_bd_ports FMC_LPC_CLK0_N] [get_bd_pins CLOCK_COUNTER/FMC_LPC_CLK0_N]
connect_bd_net -net DIFF_CLKIN_N_2 [get_bd_ports USER_SI570_CLOCK_N] [get_bd_pins CLOCK_COUNTER/USER_SI570_CLOCK_N]
connect_bd_net -net DIFF_CLKIN_N_2_1 [get_bd_ports FMC_LPC_CLK1_N] [get_bd_pins CLOCK_COUNTER/FMC_LPC_CLK1_N]
connect_bd_net -net DIFF_CLKIN_N_3 [get_bd_ports FMC_HPC_CLK0_N] [get_bd_pins CLOCK_COUNTER/FMC_HPC_CLK0_N]
connect_bd_net -net DIFF_CLKIN_N_4 [get_bd_ports FMC_HPC_CLK1_N] [get_bd_pins CLOCK_COUNTER/FMC_HPC_CLK1_N]
connect_bd_net -net DIFF_CLKIN_P_1 [get_bd_ports CLK_125MHZ_P] [get_bd_pins CLOCK_COUNTER/CLK_125MHZ_P]
connect_bd_net -net DIFF_CLKIN_P_1_1 [get_bd_ports FMC_LPC_CLK0_P] [get_bd_pins CLOCK_COUNTER/FMC_LPC_CLK0_P]
connect_bd_net -net DIFF_CLKIN_P_2 [get_bd_ports USER_SI570_CLOCK_P] [get_bd_pins CLOCK_COUNTER/USER_SI570_CLOCK_P]
connect_bd_net -net DIFF_CLKIN_P_2_1 [get_bd_ports FMC_LPC_CLK1_P] [get_bd_pins CLOCK_COUNTER/FMC_LPC_CLK1_P]
connect_bd_net -net DIFF_CLKIN_P_3 [get_bd_ports FMC_HPC_CLK0_P] [get_bd_pins CLOCK_COUNTER/FMC_HPC_CLK0_P]
connect_bd_net -net DIFF_CLKIN_P_4 [get_bd_ports FMC_HPC_CLK1_P] [get_bd_pins CLOCK_COUNTER/FMC_HPC_CLK1_P]
